# EasyEDA schematic Scheme_EasyEda_PM_Razvan_Bitea.json

## Sheets
1 Interfața serială și paralelă: TITLE: Interfața serială și paralelă; REV: 1.0
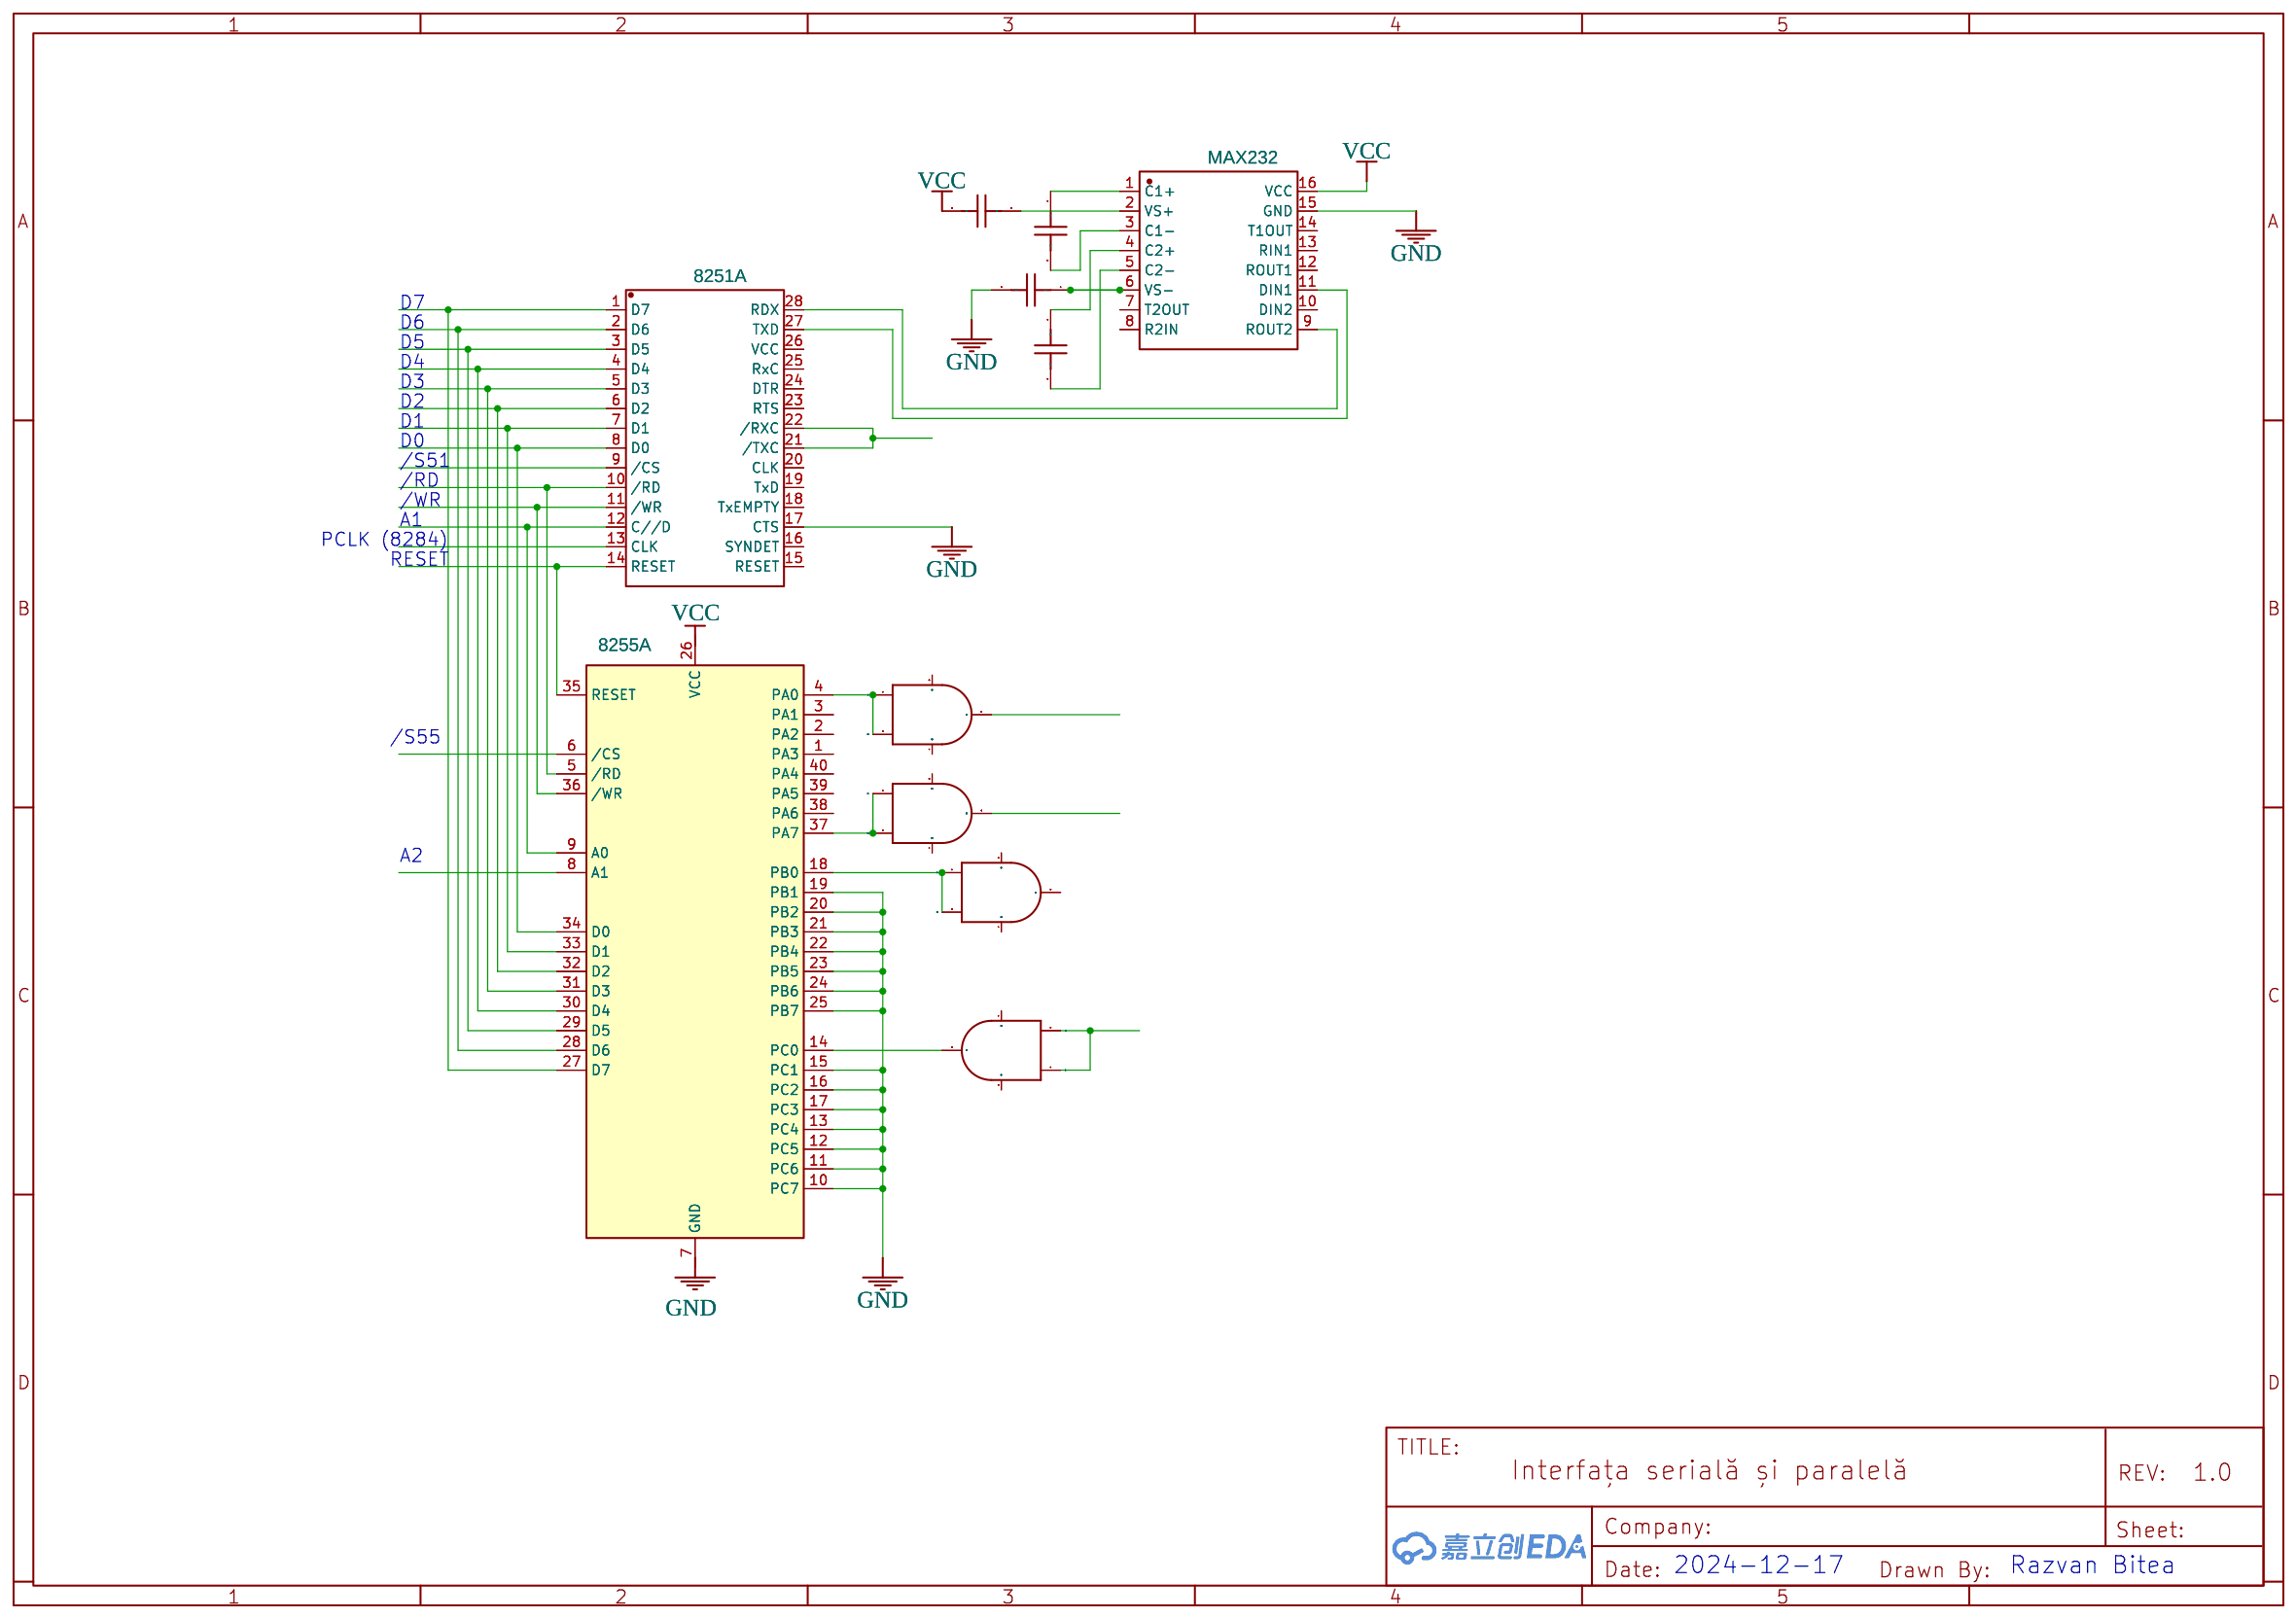
[diagram p0: Interfața serială și paralelă]
2 Conectarea memoriilor: TITLE: Conectarea memoriilor
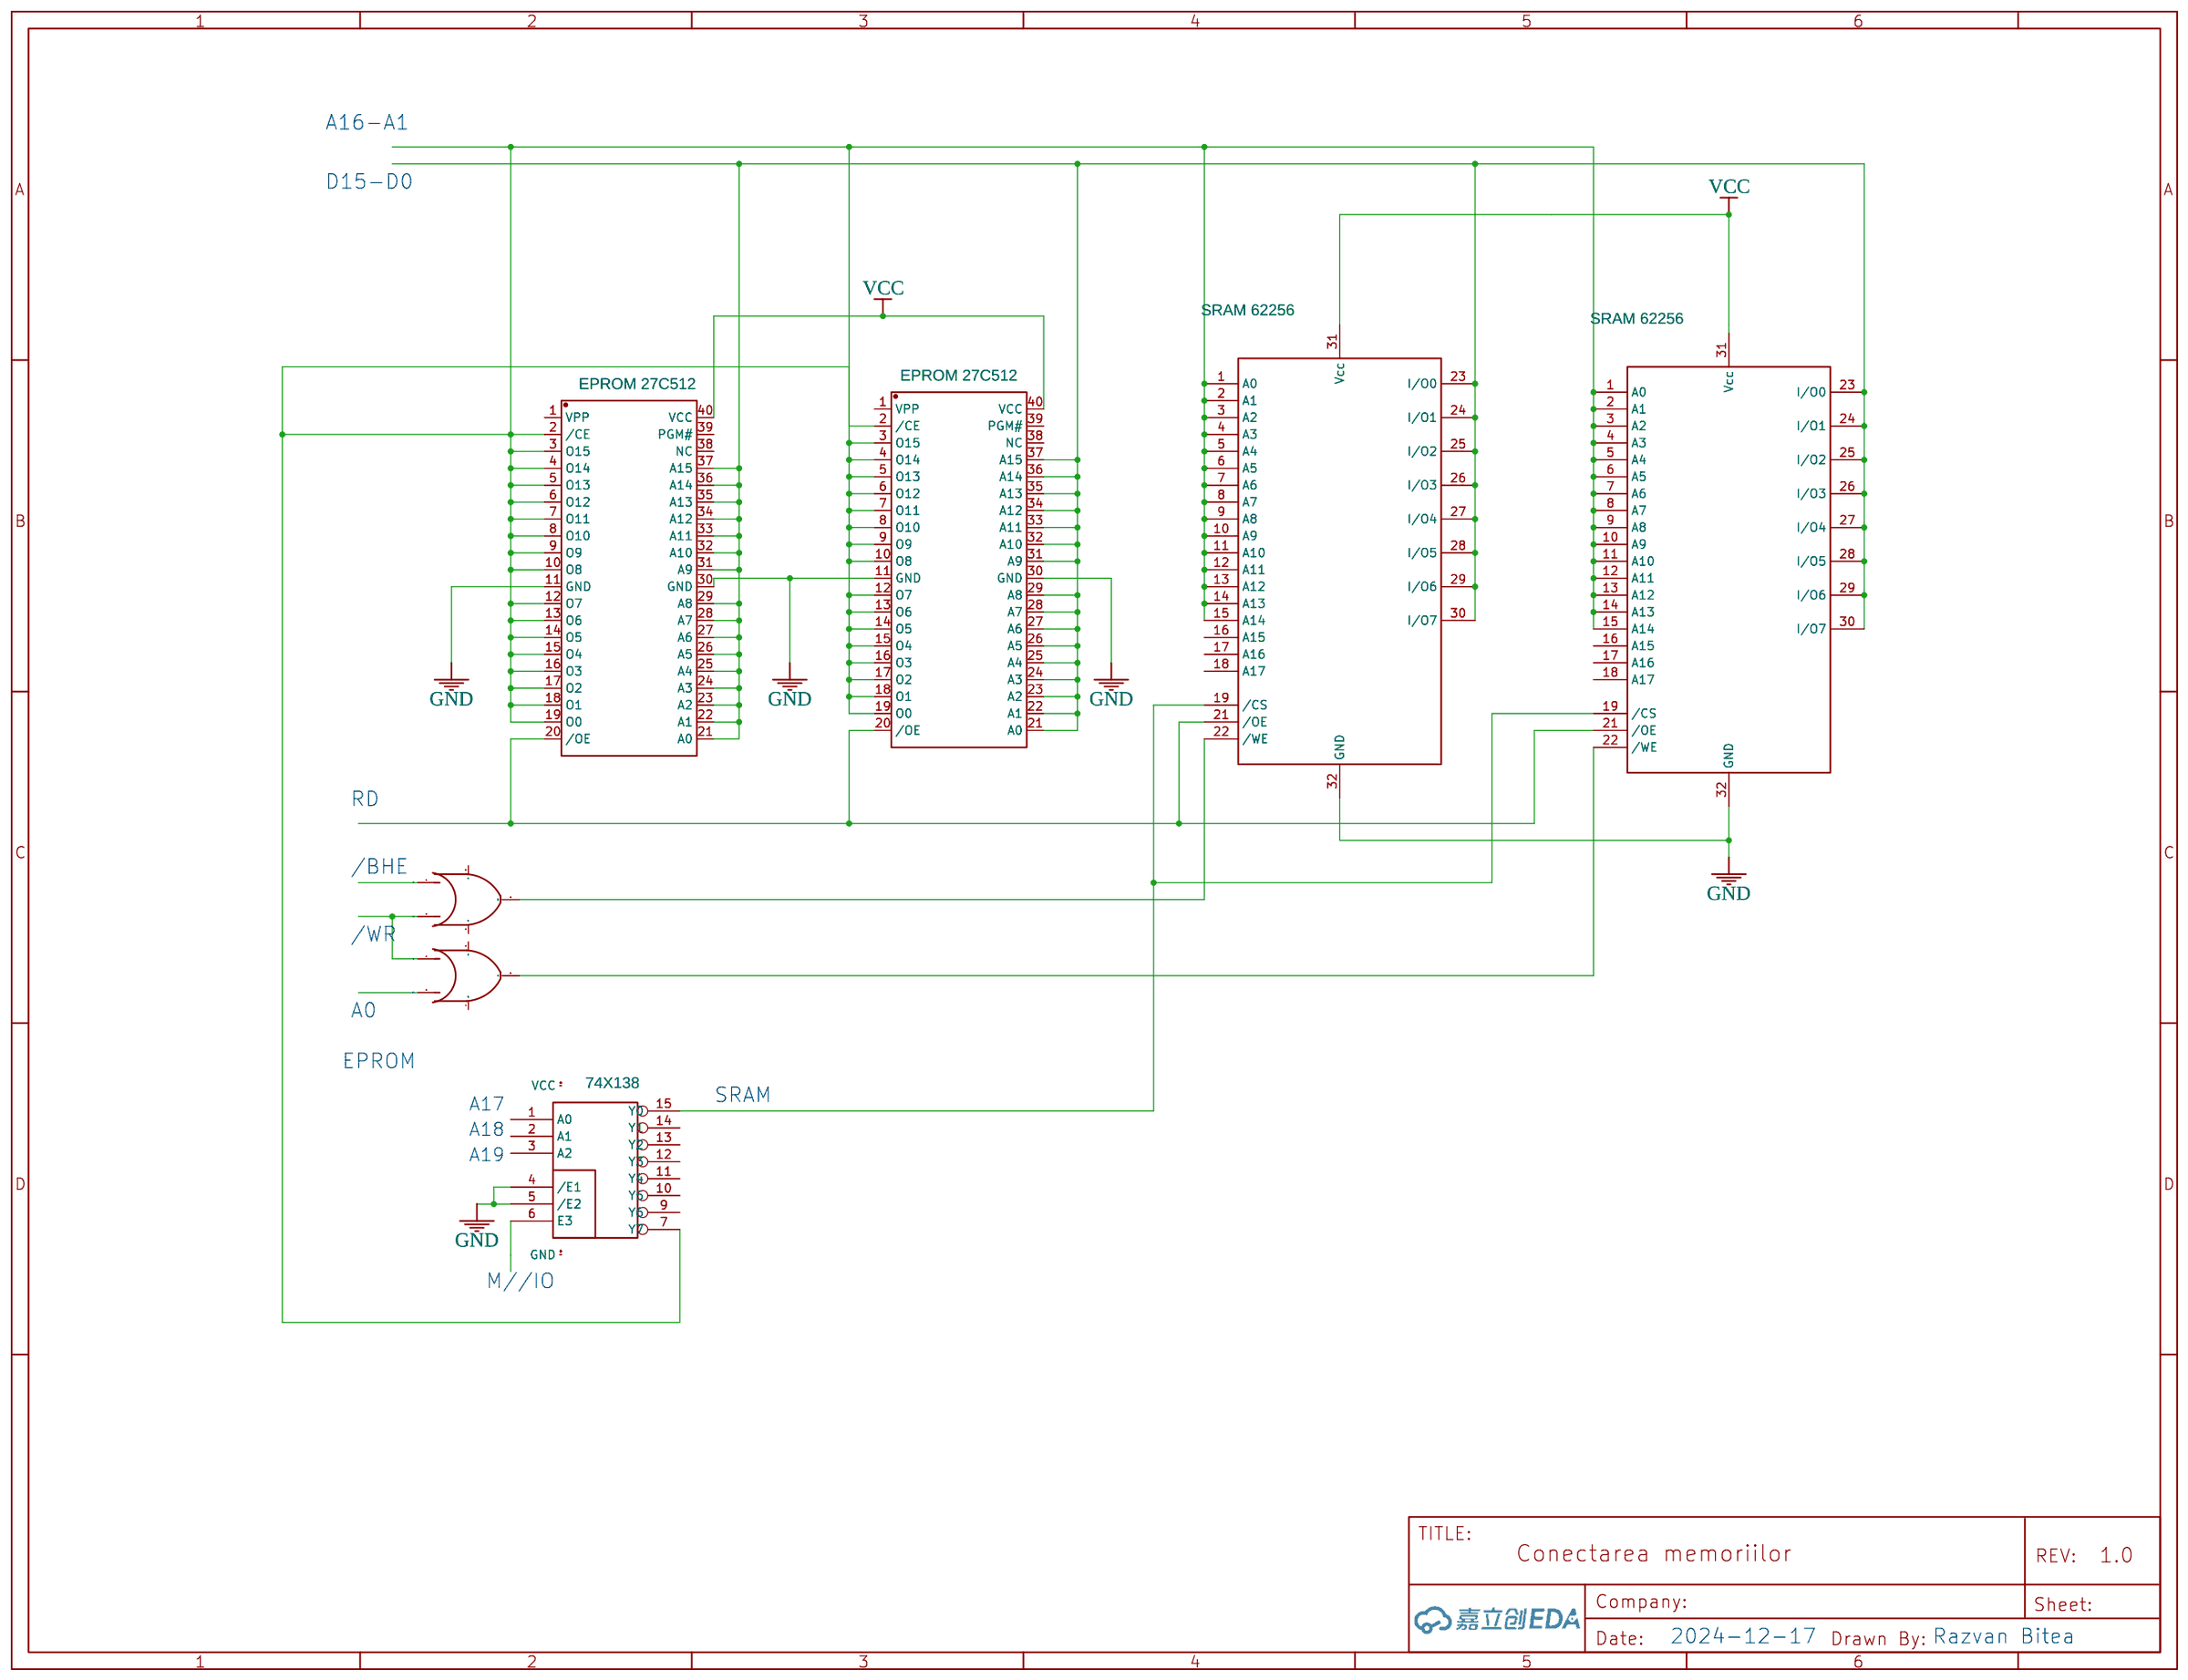
[diagram p1: Conectarea memoriilor]
3 Unitatea Centrală: TITLE: Unitatea Centrală
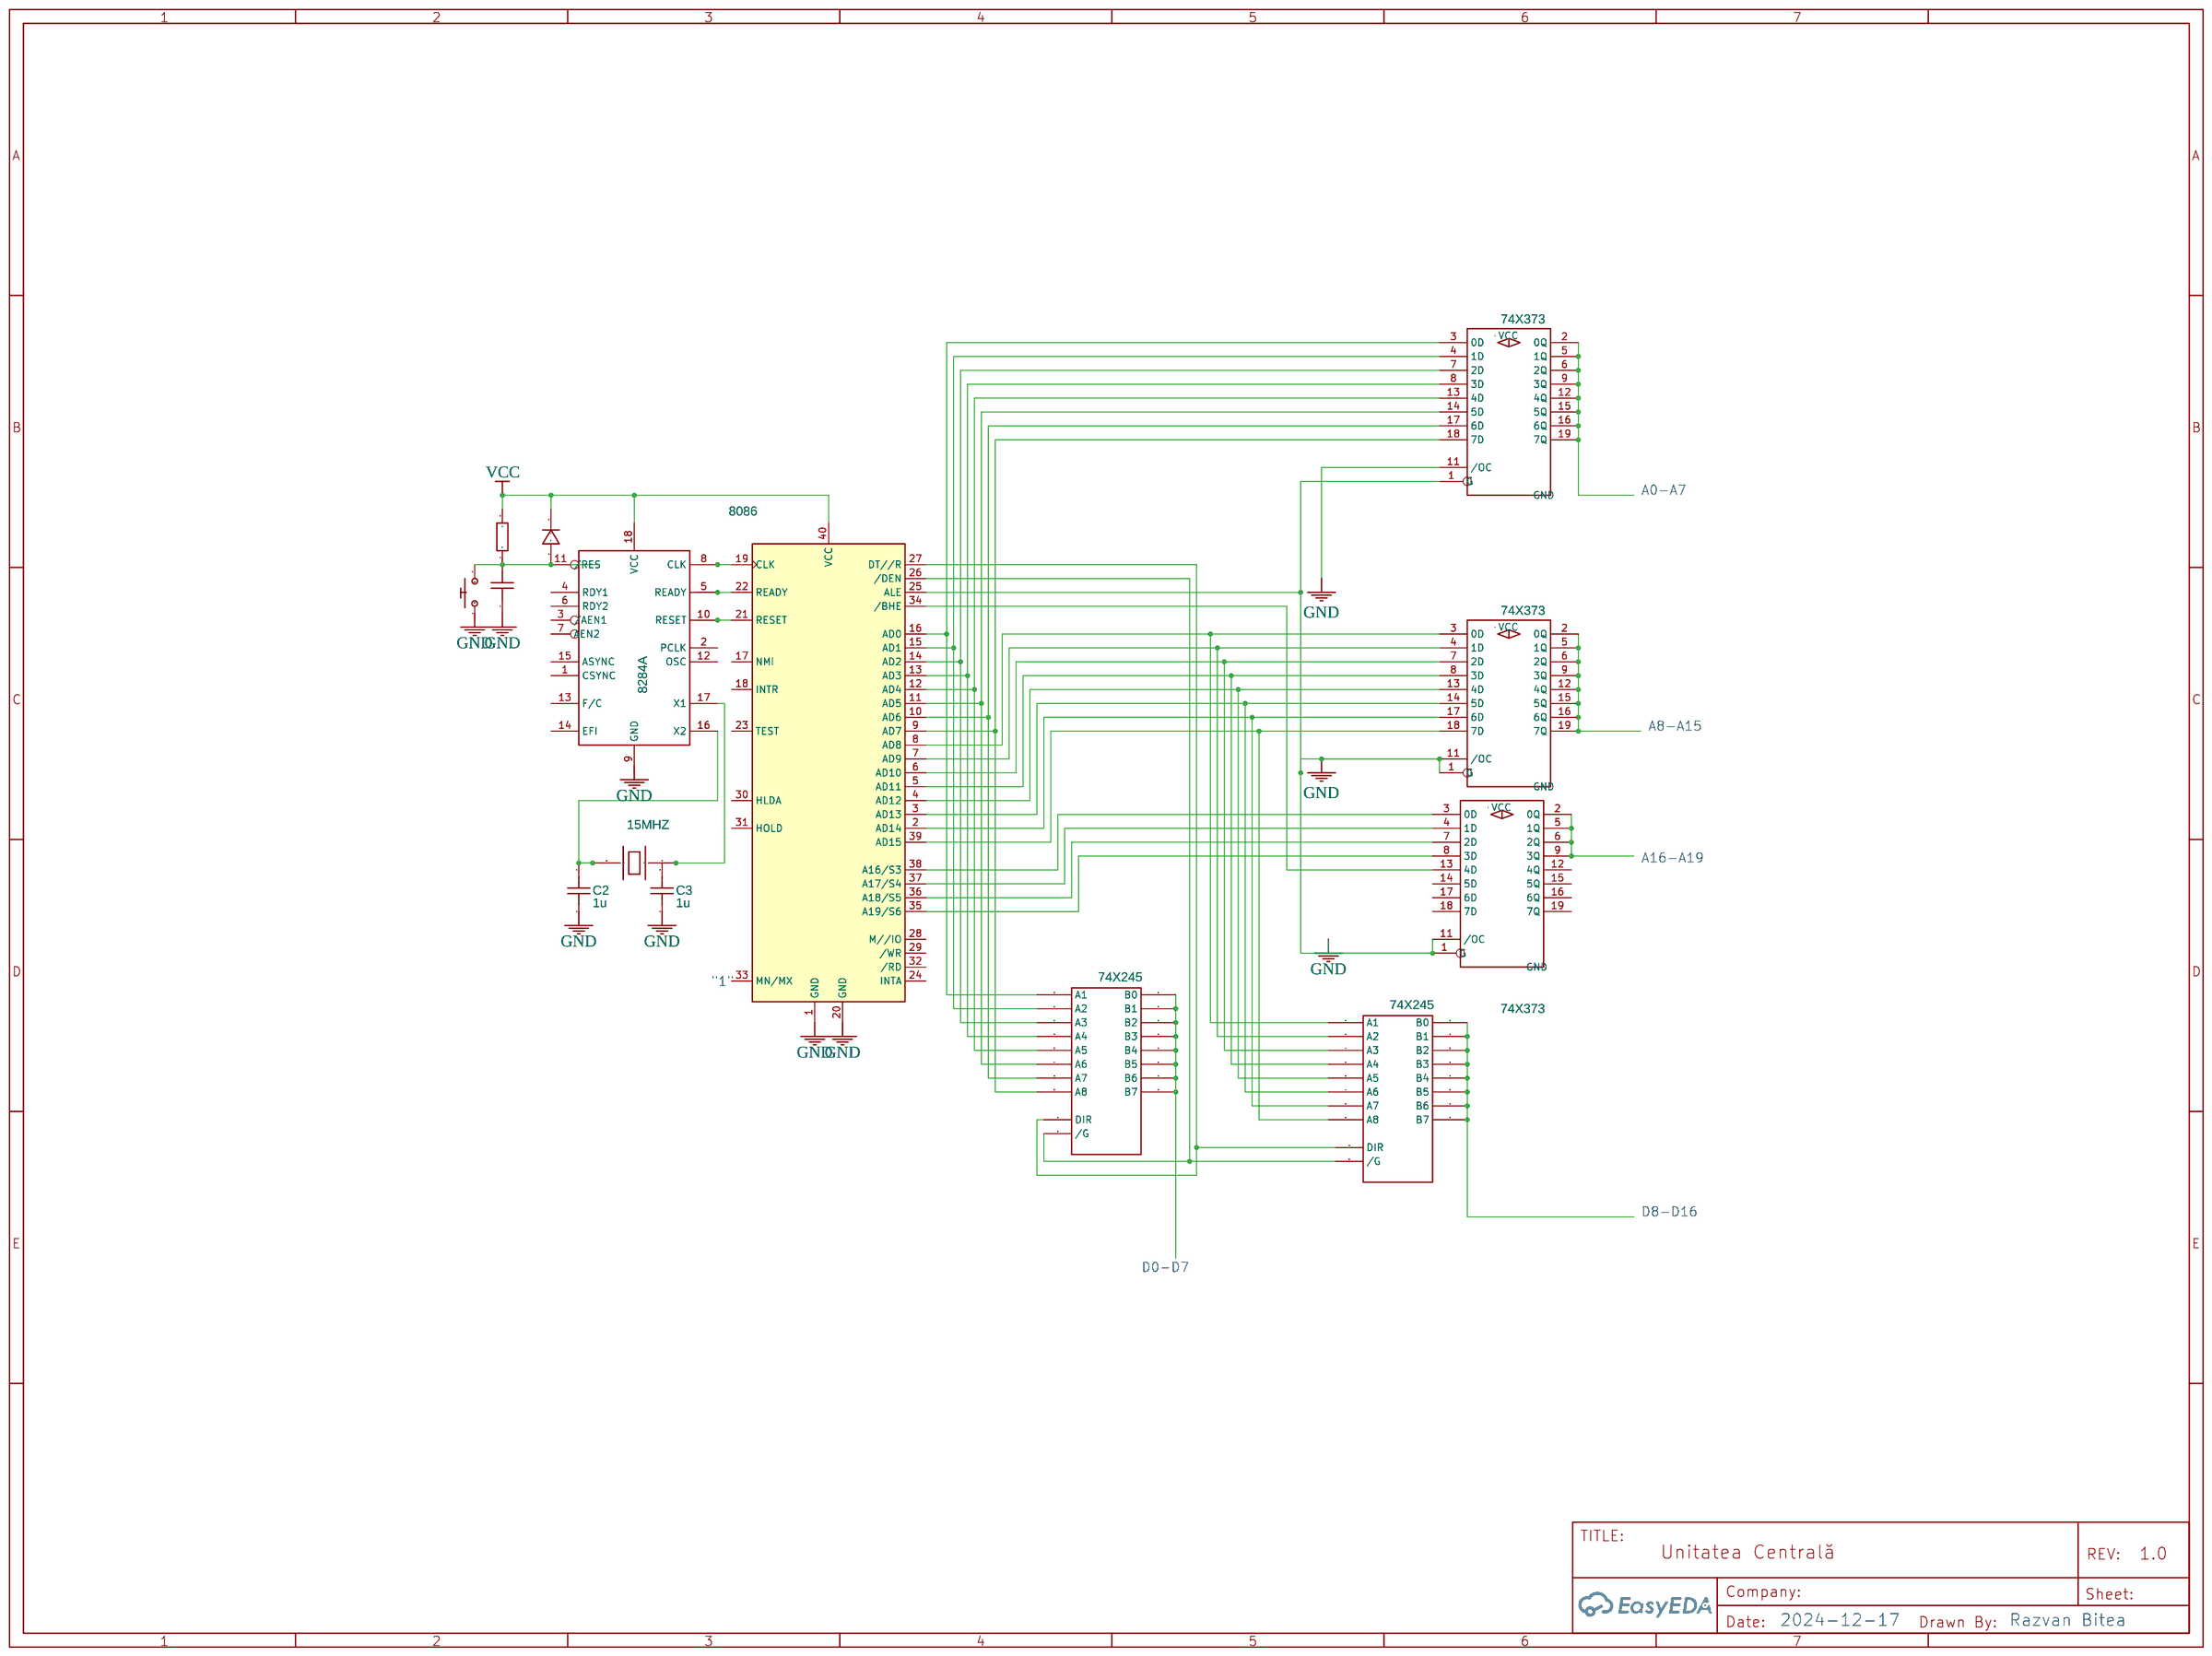
[diagram p2: Unitatea Centrală]
4 Minitastatura: TITLE: Minitastatura
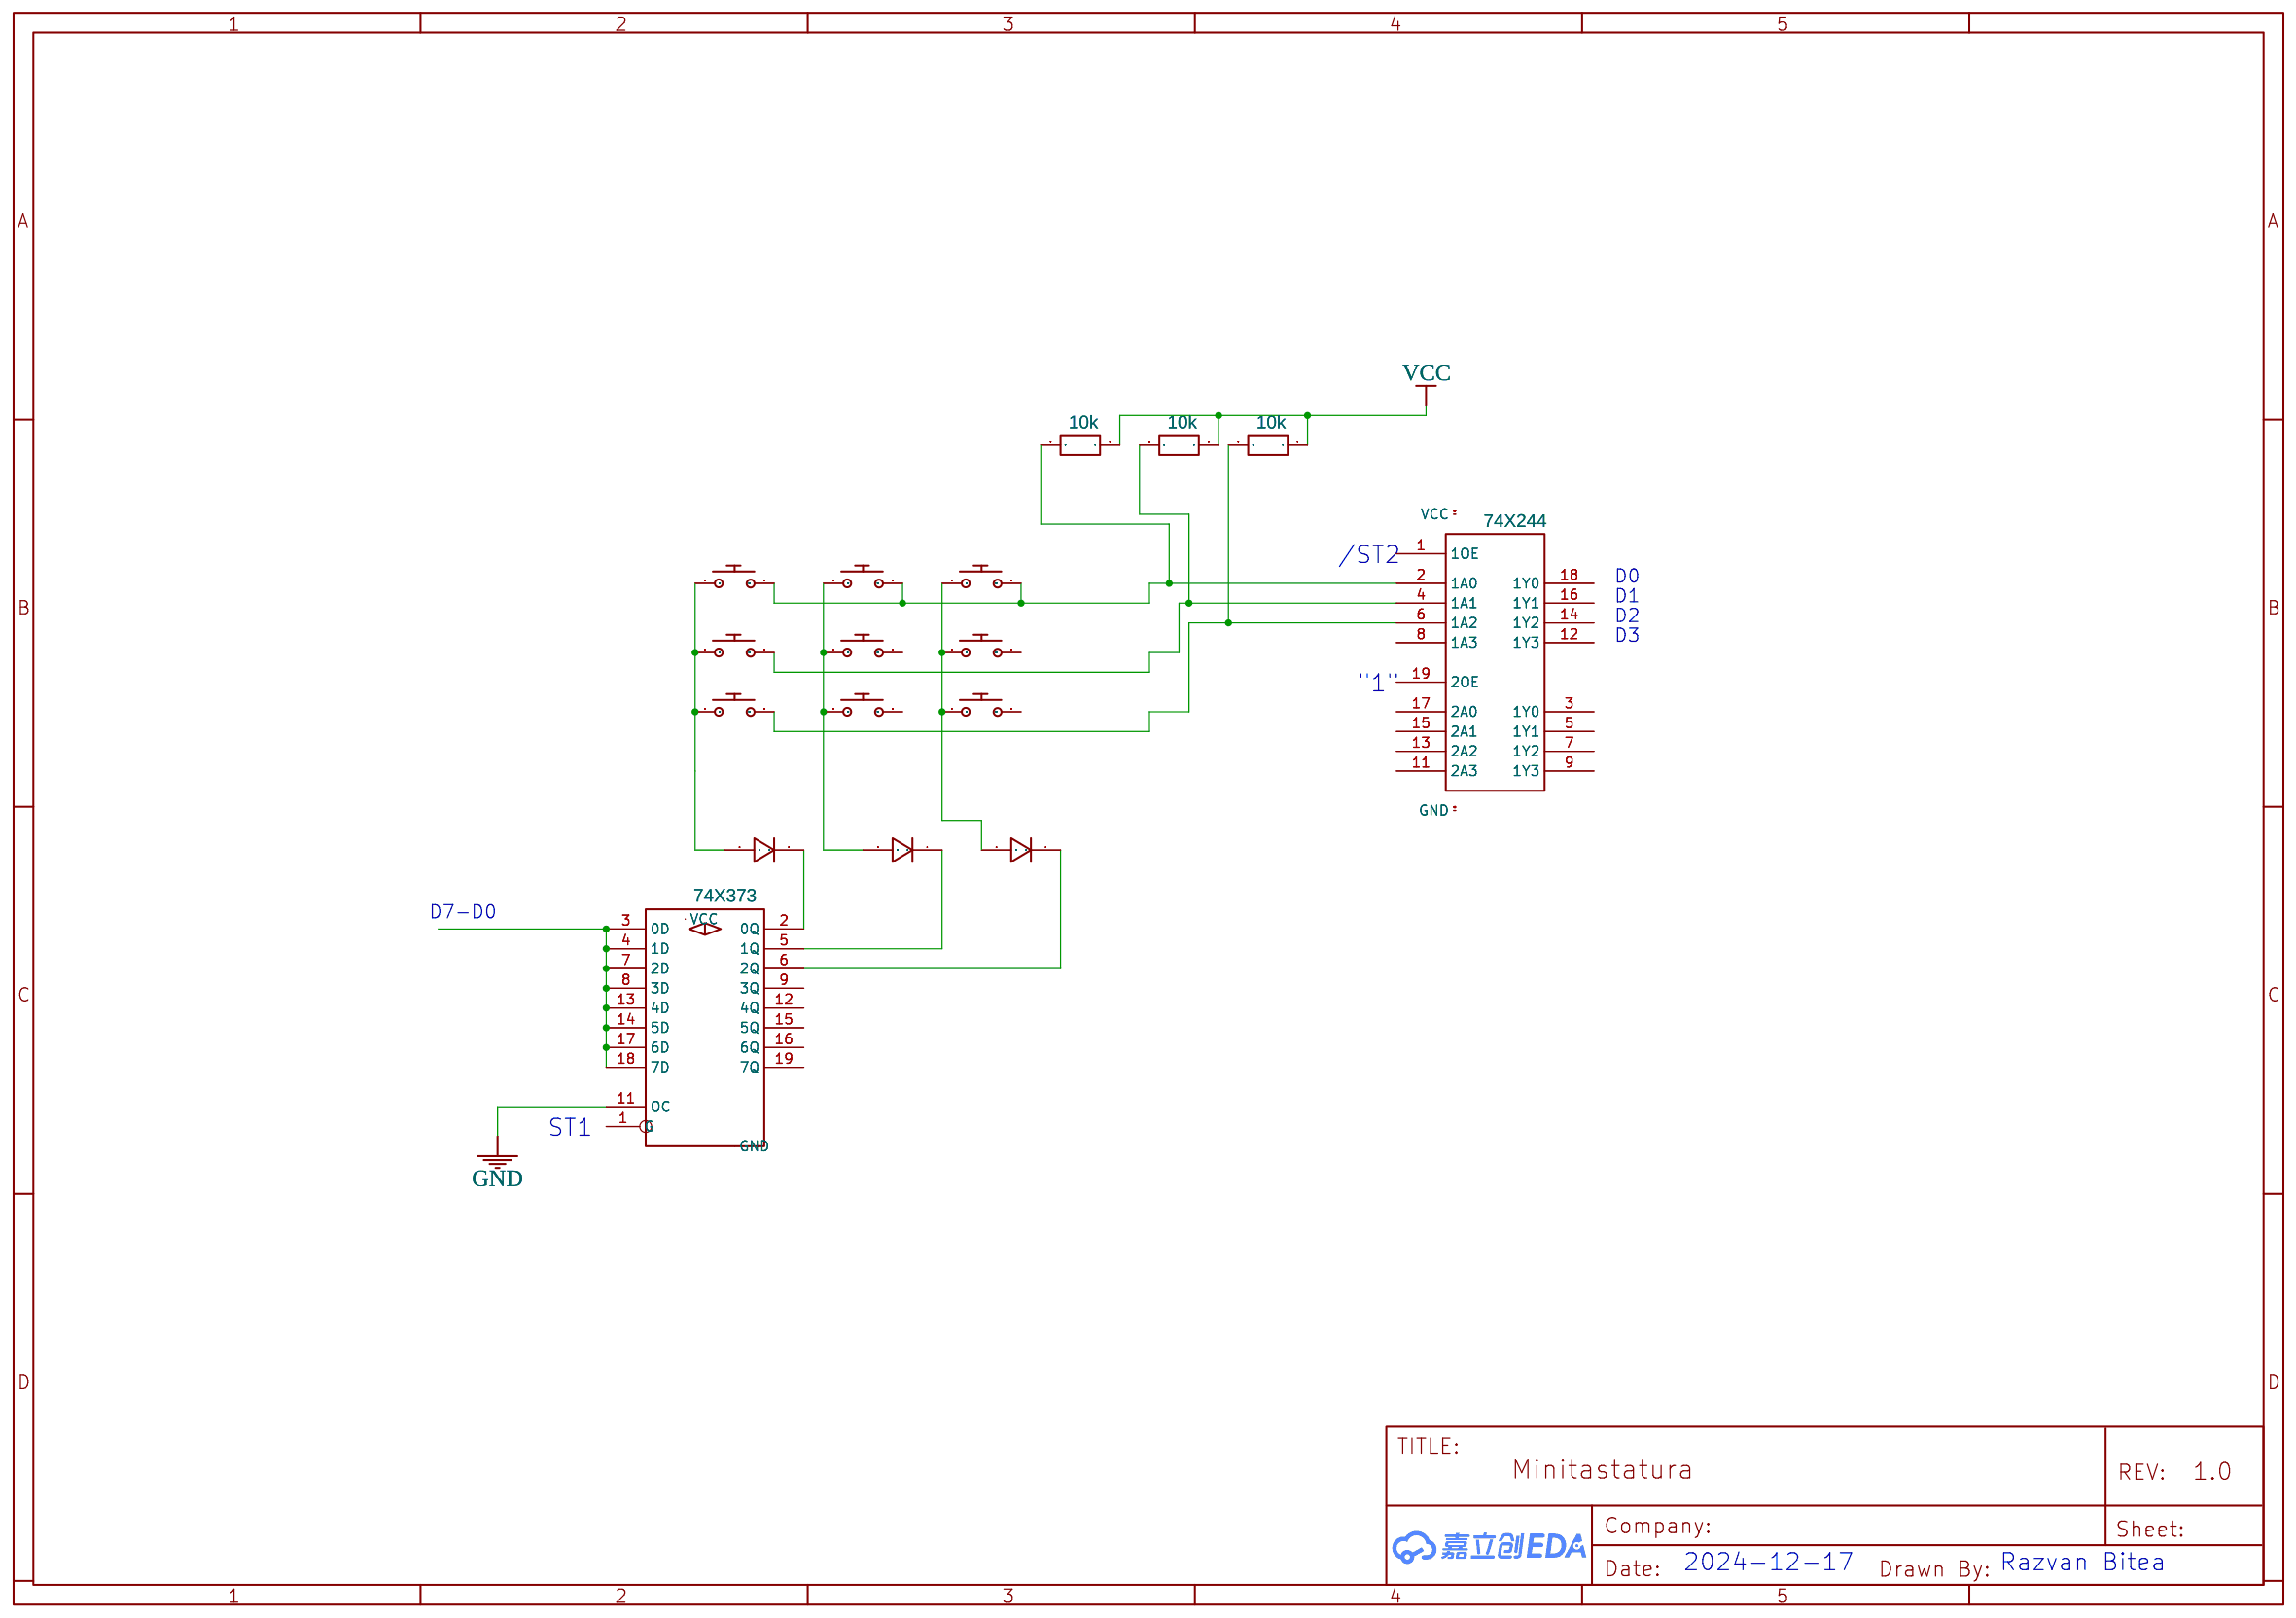
[diagram p3: Minitastatura]
5 LED-uri: TITLE: LED-uri
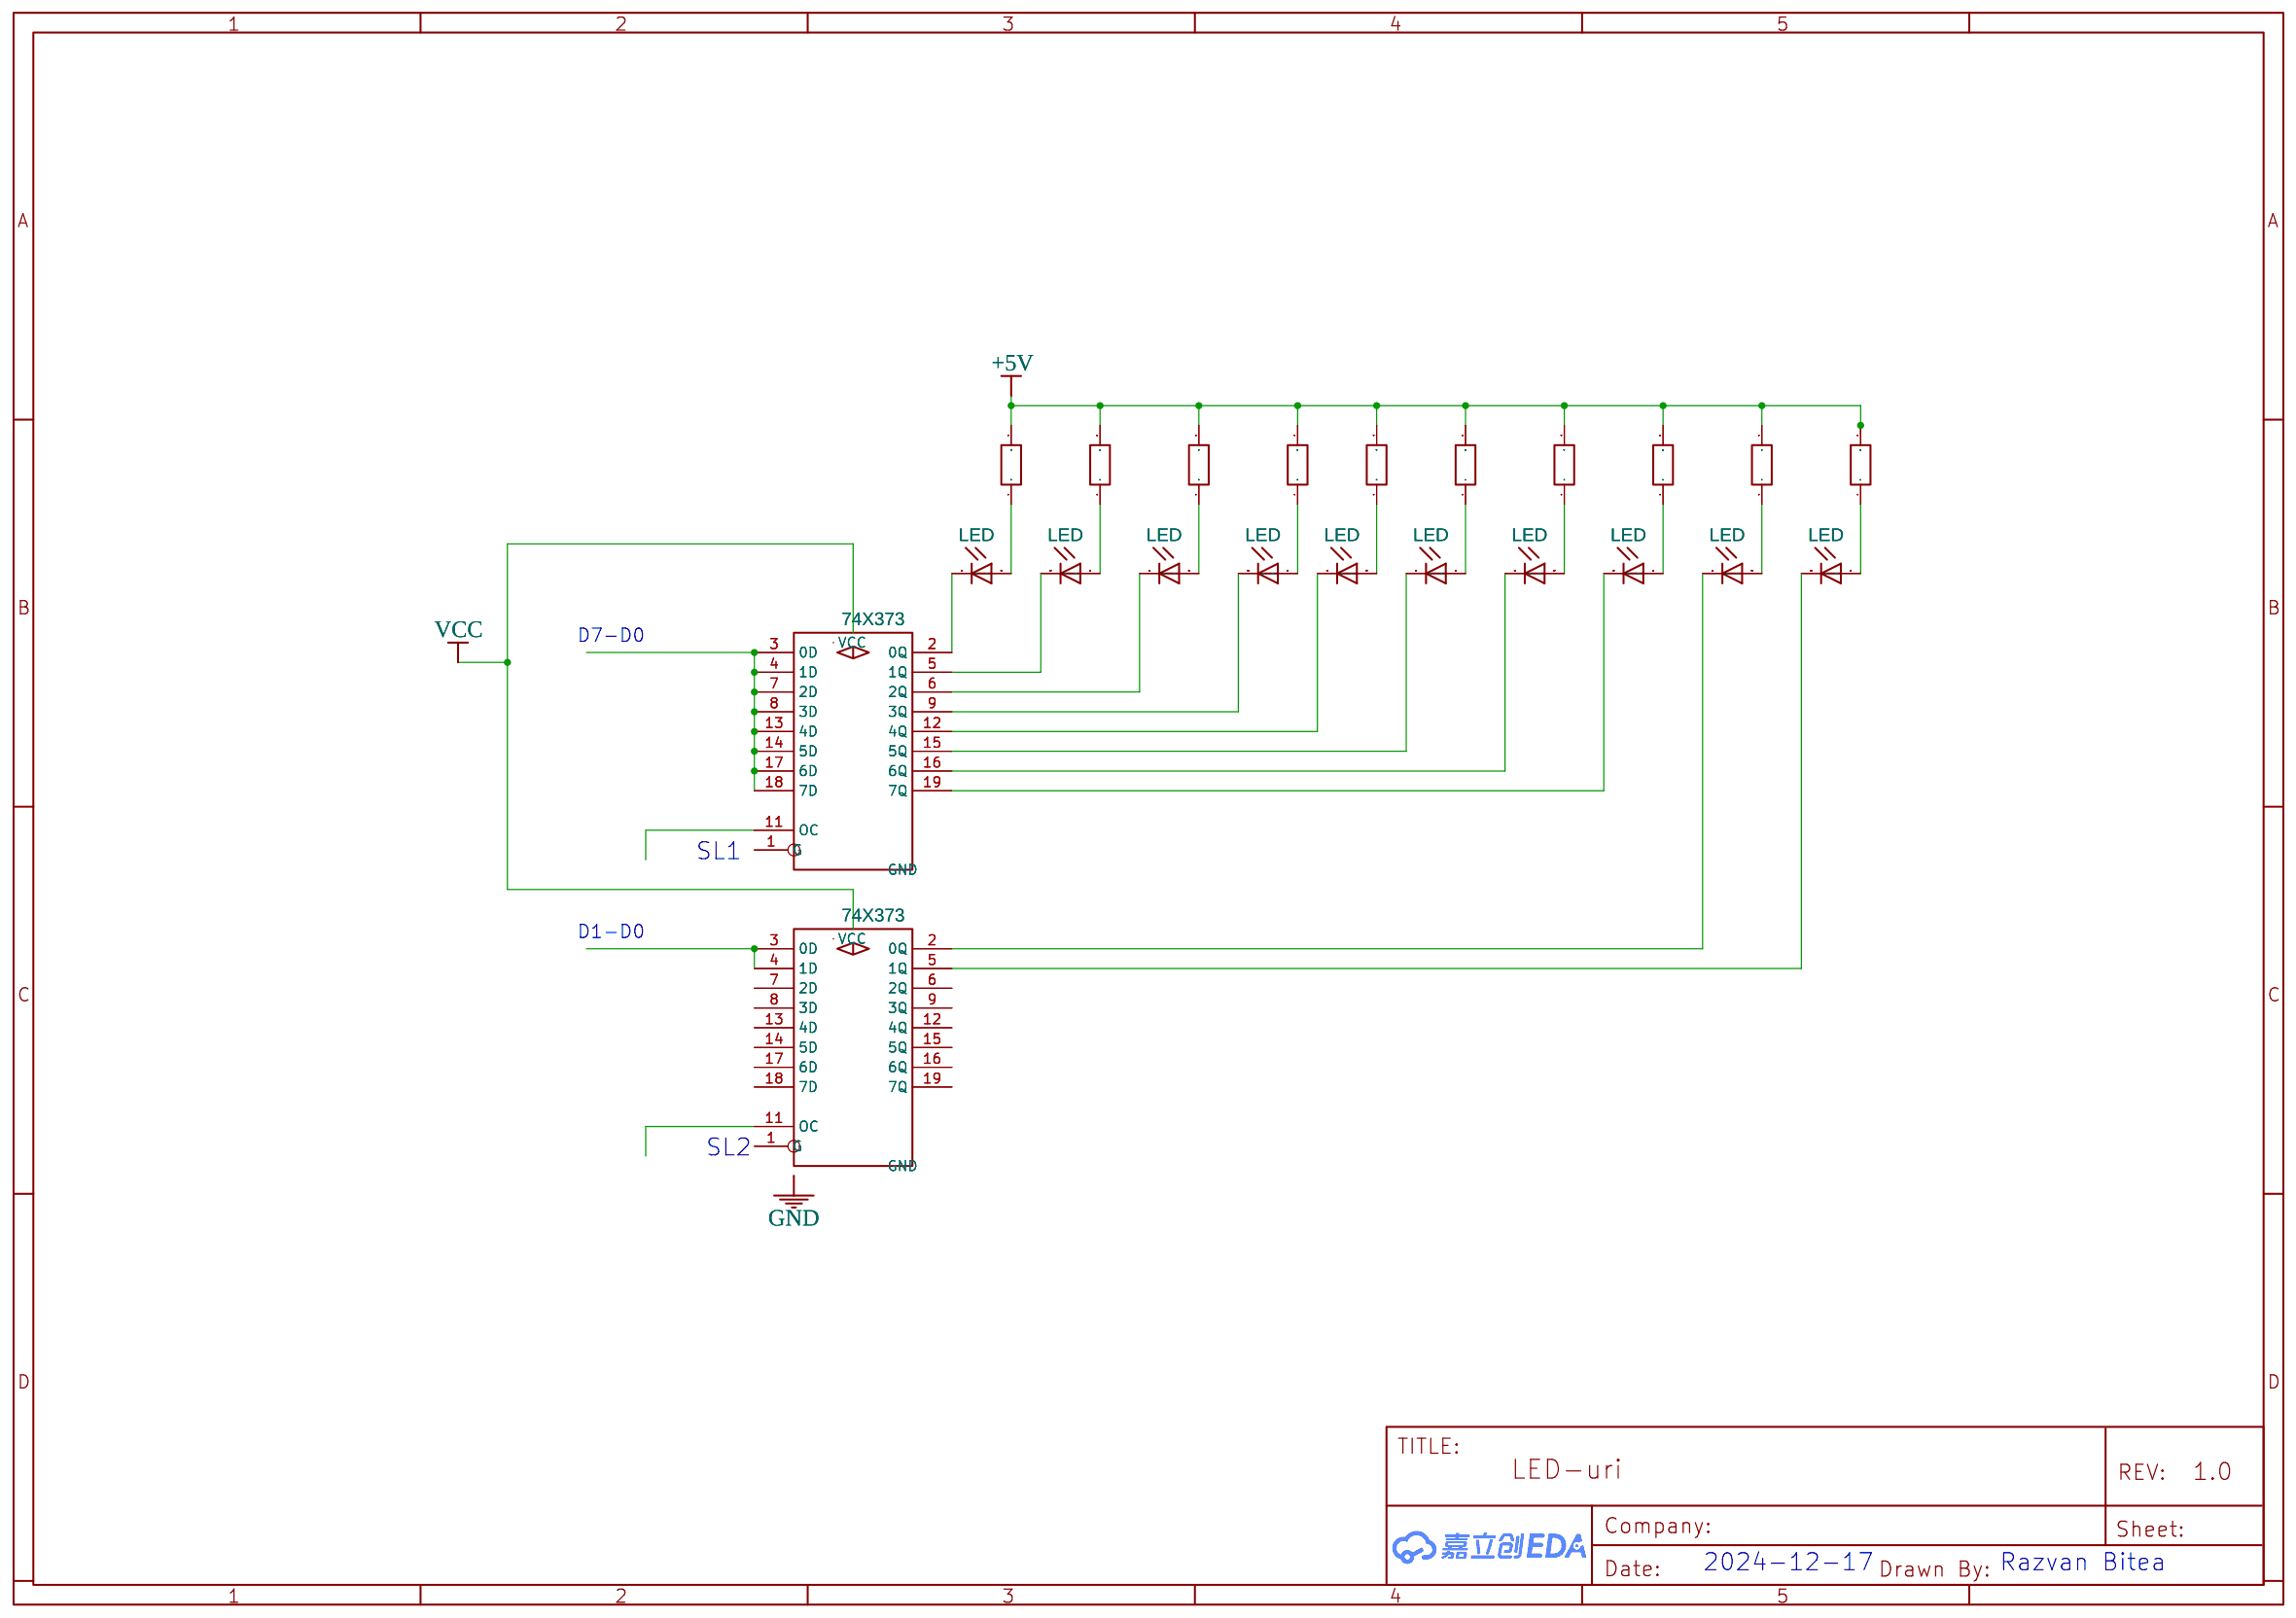
[diagram p4: LED-uri]
6 Decodificatorul de porturi: TITLE: Decodificatorul de porturi
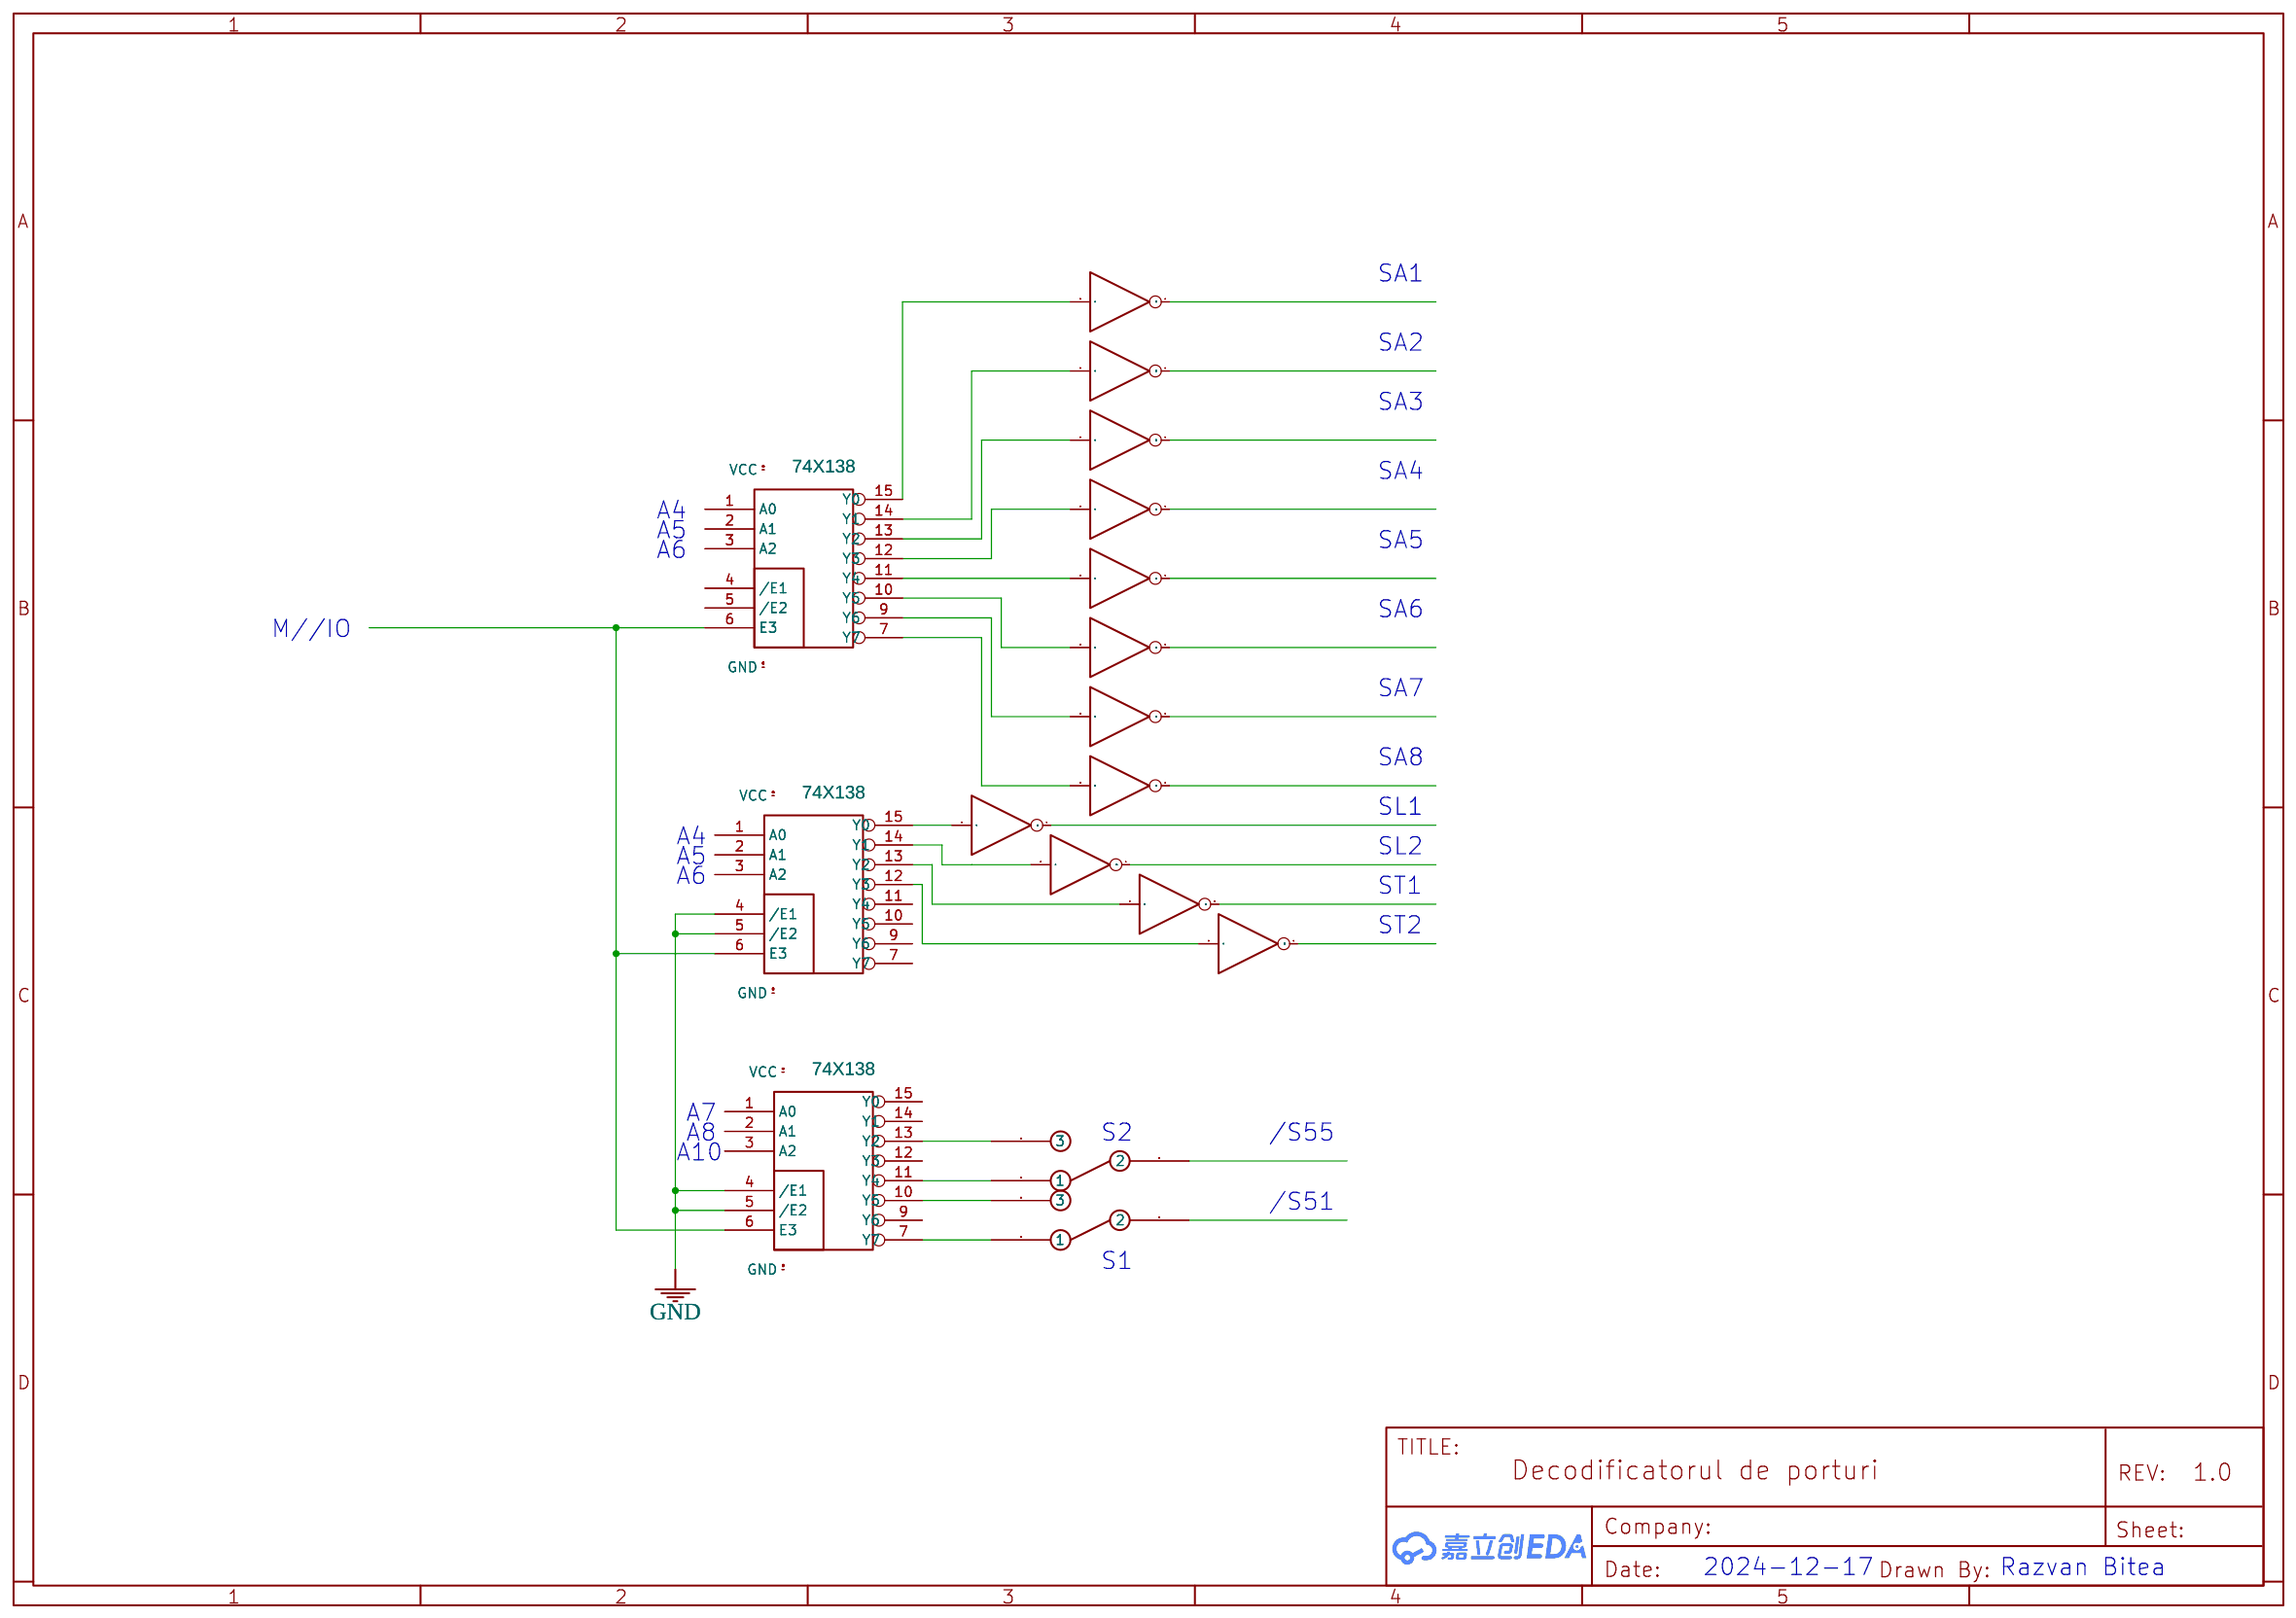
[diagram p5: Decodificatorul de porturi]
7 Afișare segmente: TITLE: Afișare segmente
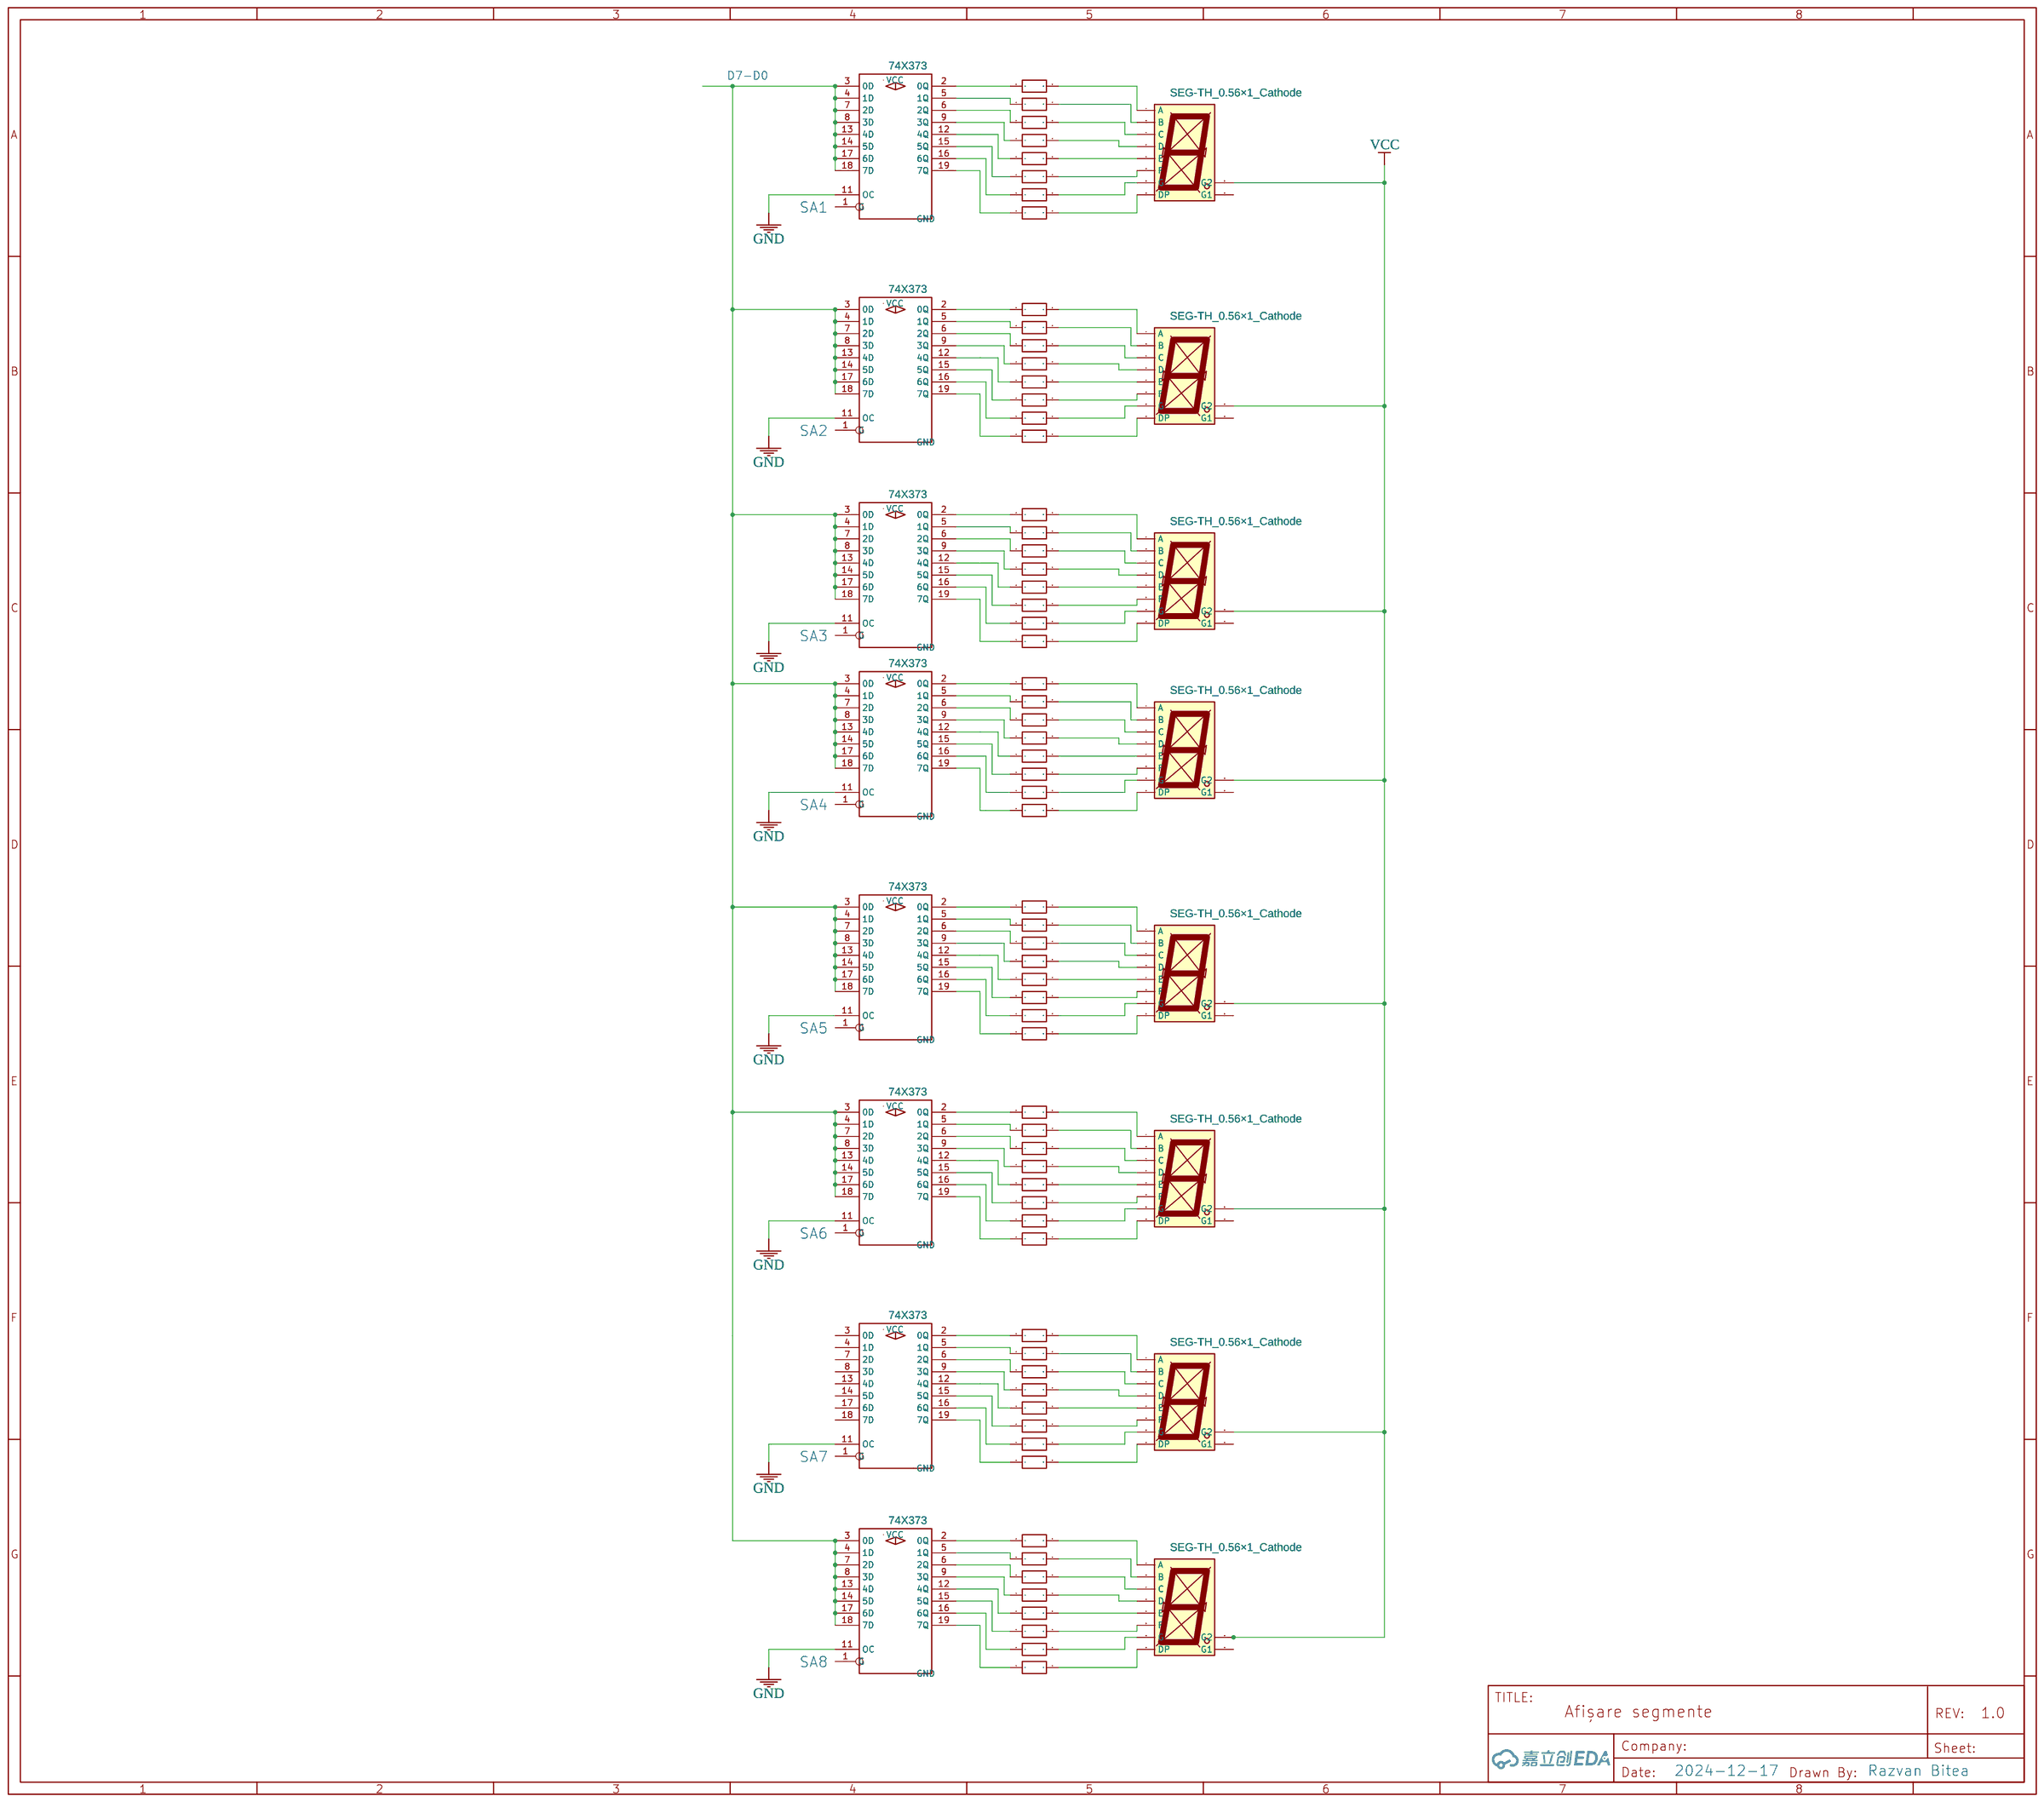
[diagram p6: Afișare segmente]

## Parts
sheet Afișare segmente
R14  1k  [R0603]
R15  1k  [R0603]
R16  1k  [R0603]
R17  1k  [R0603]
R18  1k  [R0603]
R19  1k  [R0603]
R20  1k  [R0603]
R21  1k  [R0603]
R22  1k  [R0603]
R23  1k  [R0603]
R24  1k  [R0603]
R25  1k  [R0603]
R26  1k  [R0603]
R27  1k  [R0603]
R28  1k  [R0603]
R29  1k  [R0603]
R30  1k  [R0603]
R31  1k  [R0603]
R32  1k  [R0603]
R33  1k  [R0603]
R34  1k  [R0603]
R35  1k  [R0603]
R36  1k  [R0603]
R37  1k  [R0603]
R38  1k  [R0603]
R39  1k  [R0603]
R40  1k  [R0603]
R41  1k  [R0603]
R42  1k  [R0603]
R43  1k  [R0603]
R44  1k  [R0603]
R45  1k  [R0603]
R46  1k  [R0603]
R47  1k  [R0603]
R48  1k  [R0603]
R49  1k  [R0603]
R50  1k  [R0603]
R51  1k  [R0603]
R52  1k  [R0603]
R53  1k  [R0603]
R54  1k  [R0603]
R55  1k  [R0603]
R56  1k  [R0603]
R57  1k  [R0603]
R58  1k  [R0603]
R59  1k  [R0603]
R60  1k  [R0603]
R61  1k  [R0603]
R62  1k  [R0603]
R63  1k  [R0603]
R64  1k  [R0603]
R65  1k  [R0603]
R66  1k  [R0603]
R67  1k  [R0603]
R68  1k  [R0603]
R69  1k  [R0603]
R70  1k  [R0603]
R71  1k  [R0603]
R72  1k  [R0603]
R73  1k  [R0603]
R74  1k  [R0603]
R75  1k  [R0603]
R76  1k  [R0603]
R77  1k  [R0603]
SEG1  SEG-TH_0.56×1_Cathode  [LED-SEG-TH_10P-L12.6-W19.0-P2.54-S15.24-BL]
SEG2  SEG-TH_0.56×1_Cathode  [LED-SEG-TH_10P-L12.6-W19.0-P2.54-S15.24-BL]
SEG3  SEG-TH_0.56×1_Cathode  [LED-SEG-TH_10P-L12.6-W19.0-P2.54-S15.24-BL]
SEG4  SEG-TH_0.56×1_Cathode  [LED-SEG-TH_10P-L12.6-W19.0-P2.54-S15.24-BL]
SEG5  SEG-TH_0.56×1_Cathode  [LED-SEG-TH_10P-L12.6-W19.0-P2.54-S15.24-BL]
SEG6  SEG-TH_0.56×1_Cathode  [LED-SEG-TH_10P-L12.6-W19.0-P2.54-S15.24-BL]
SEG7  SEG-TH_0.56×1_Cathode  [LED-SEG-TH_10P-L12.6-W19.0-P2.54-S15.24-BL]
SEG8  SEG-TH_0.56×1_Cathode  [LED-SEG-TH_10P-L12.6-W19.0-P2.54-S15.24-BL]
U69  74X373  [DIP20]
U70  74X373  [DIP20]
U71  74X373  [DIP20]
U72  74X373  [DIP20]
U73  74X373  [DIP20]
U74  74X373  [DIP20]
U75  74X373  [DIP20]
U76  74X373  [DIP20]
sheet Conectarea memoriilor
U9  74X138  [IC16]
U10  EPROM 27C512  [PDIP-40_L52.3-W13.8-P2.54-LS15.2-BL]
U11  EPROM 27C512  [PDIP-40_L52.3-W13.8-P2.54-LS15.2-BL]
U12  SRAM 62256  [62512]
U13  SRAM 62256  [62512]
U14  OrGate  [DIP]
U15  OrGate  [DIP]
sheet Decodificatorul de porturi
SW1  1_2_Both_Switch  [DPDT PADDLE SWITCH MOUNTAIN SWITCH]
SW2  1_2_Both_Switch  [DPDT PADDLE SWITCH MOUNTAIN SWITCH]
U8  INVERTER
U16  74X138  [IC16]
U17  74X138  [IC16]
U18  74X138  [IC16]
U19  INVERTER
U21  INVERTER
U22  INVERTER
U23  INVERTER
U24  INVERTER
U25  INVERTER
U26  INVERTER
U27  INVERTER
U28  INVERTER
U77  INVERTER
U78  INVERTER
sheet Interfața serială și paralelă
C4  0.1u  [C0603]
C5  0.1u  [C0603]
C6  0.1u  [C0603]
C7  0.1u  [C0603]
U20  8251A  [DIP-28_L37.0-W13.8-P2.54-LS15.8-BL]
U60  8255A  [DIP-40_W15.24MM]
U61  MAX232  [PDIP-16_L19.7-W6.6-P2.54-LS7.6-BL]
U62  AND2EE_US
U63  AND2EE_US
U64  AND2EE_US
U67  AND2EE_US
sheet LED-uri
LED1  LED  [CHIPLED-0603-TTW]
LED2  LED  [CHIPLED-0603-TTW]
LED3  LED  [CHIPLED-0603-TTW]
LED4  LED  [CHIPLED-0603-TTW]
LED5  LED  [CHIPLED-0603-TTW]
LED6  LED  [CHIPLED-0603-TTW]
LED7  LED  [CHIPLED-0603-TTW]
LED8  LED  [CHIPLED-0603-TTW]
LED9  LED  [CHIPLED-0603-TTW]
LED10  LED  [CHIPLED-0603-TTW]
R6  1k  [R0603]
R7  1k  [R0603]
R8  1k  [R0603]
R9  1k  [R0603]
R10  1k  [R0603]
R11  1k  [R0603]
R12  1k  [R0603]
R13  1k  [R0603]
R78  1k  [R0603]
R79  1k  [R0603]
U68  74X373  [DIP20]
U79  74X373  [DIP20]
sheet Minitastatura
D2  1N4007W  [SOD-123_L2.8-W1.8-LS3.7-RD]
D3  1N4007W  [SOD-123_L2.8-W1.8-LS3.7-RD]
D4  1N4007W  [SOD-123_L2.8-W1.8-LS3.7-RD]
R2  10k  [R0603]
R3  10k  [R0603]
R4  10k  [R0603]
SW-2SWITCH  Push Button  [SMD-BUTTON]
SW-3SWITCH  Push Button  [SMD-BUTTON]
SW-4SWITCH  Push Button  [SMD-BUTTON]
SW-7SWITCH  Push Button  [SMD-BUTTON]
SW-8SWITCH  Push Button  [SMD-BUTTON]
SW-9SWITCH  Push Button  [SMD-BUTTON]
SW-11SWITCH  Push Button  [SMD-BUTTON]
SW-12SWITCH  Push Button  [SMD-BUTTON]
SW-13SWITCH  Push Button  [SMD-BUTTON]
U65  74X244  [IC20]
U66  74X373  [DIP20]
sheet Unitatea Centrală
15MHZ  SMAQ-5032A  [IQG5032A]
C1  C1  [RAD-0.1]
C2  1u  [RAD-0.1]
C3  1u  [RAD-0.1]
D1  1N4448  [DO-35]
R1  1k  [AXIAL-0.3]
SW-1SWITCH  Push Button  [SMD-BUTTON]
U1  8086  [DIP-40_W15.24MM]
U2  74X373  [DIP20]
U3  8284A  [DIP18]
U4  74X373  [DIP20]
U5  74X373  [DIP20]
U6  74X245  [IC20]
U7  74X245  [IC20]

## Library data of the parts
R2-R4 R6-R79 = R_0603_EU: Contributor: LCEDA_Lib
SEG1-SEG8 = SEG-TH_0.56×1_Cathode: Manufacturer: 志浩; Supplier Part: C8093; Contributor: LCEDA_01
U2 U4 U5 U66 U68-U76 U79 = 74X373N: Octal Transparent Latch with 3-State Outputs; Contributor: Rhyno
U9 U16-U18 = 74X138: Contributor: KiCad
U10 U11 = AT27C1024-45PU: Supplier: LCSC; Supplier Part: C220831; Manufacturer: Microchip Tech; Contributor: LCSC; JLCPCB Part Class: Extended Part
U12 U13 = SRAM 62512: Manufacturer Part: x; Contributor: laurovicimihaela
U14 U15 = OrGate: Contributor: andyfierman
SW1 SW2 = 1_2_Both_Switch: Contributor: iuliavoit
U8 U19 U21-U28 U77 U78 = LOGIC: Contributor: ale.tuninetti; sim: true
C4-C7 = C_0603_US: Contributor: LCEDA_Lib
U20 = P8251A: Manufacturer: Microchip Tech; Manufacturer Part: AT27C256R-45PU; Contributor: Peter2022; JLCPCB Part Class: Extended Part
U60 = 8255A: Contributor: JohnH1234
U61 = MAX232EING4: Supplier: LCSC; Supplier Part: C1545083; Manufacturer: TI(德州仪器); link: https://atta.szlcsc.comnull; Contributor: lcsc
U62-U64 U67 = LOGIC: Contributor: EasyEDA
LED1-LED10 = LED: Contributor: Adafruit
D2-D4 = 1N4007W: Supplier: LCSC; Supplier Part: C328592; Manufacturer: BLUE ROCKET; Contributor: LCEDA_Lib
SW-1SWITCH SW-2SWITCH SW-3SWITCH SW-4SWITCH SW-7SWITCH SW-8SWITCH SW-9SWITCH SW-11SWITCH SW-12SWITCH SW-13SWITCH = -: sourceId: M82WewO60; Supplier Part: COM-08720; Supplier: SparkFun; Manufacturer Part: ?
U65 = 74X244: Contributor: KiCad
15MHZ = -: Manufacturer Part: ?
C1-C3 = Cap_RAD-0.1_US: Manufacturer Part: ?
D1 = -: Supplier Part: C54037; Supplier: LCSC; Manufacturer: SEMTECH; image: //image.lceda.cn/szlcsc/C54037.jpg
R1 = Res_AXIAL-0.3(1/8W)_EU: Manufacturer Part: ?
U1 = -: Contributor: KiCAD; license: https://www.gnu.org/licenses/lgpl-2.1.html; Manufacturer Part: ?
U3 = 8284A: Contributor: rory.slegtenhorst; sourceId: BnlH3MK6Q; Manufacturer Part: ?
U6 U7 = 74X245: Contributor: ioana; Package Display: No

## Nets
+5V: R6.2 R7.2 R8.2 R9.2 R10.2 R11.2 R12.2 R13.2 R78.2 R79.2
GND: C1.1 C5.2 U1.1(GND) U1.20(GND) U1.25(ALE) U2.1(G) U2.11(/OC) U4.1(G) U4.11(/OC) U5.1(G) U5.11(/OC) U9.4(/E1) U9.5(/E2) U10.11(GND) U10.30(GND) U11.11(GND) U11.30(GND) U12.32(GND) U13.32(GND) U17.4(/E1) U17.5(/E2) U18.4(/E1) U18.5(/E2) U20.17(CTS) U60.10(PC7) U60.11(PC6) U60.12(PC5) U60.13(PC4) U60.15(PC1) U60.16(PC2) U60.17(PC3) U60.19(PB1) U60.20(PB2) U60.21(PB3) U60.22(PB4) U60.23(PB5) U60.24(PB6) U60.25(PB7) U61.15(GND) U66.11(OC) U69.11(OC) U70.11(OC) U71.11(OC) U72.11(OC) U73.11(OC) U74.11(OC) U75.11(OC) U76.11(OC)
VCC: C7.2 D1.2(K) R1.2 R2.1 R3.1 R4.1 SEG1.8(G2) SEG2.8(G2) SEG3.8(G2) SEG4.8(G2) SEG5.8(G2) SEG6.8(G2) SEG7.8(G2) SEG8.8(G2) U1.40(VCC) U3.18(VCC) U10.40(VCC) U11.40(VCC) U12.31(Vcc) U13.31(Vcc) U61.16(VCC)
Net-(15MHZ-P$1): 15MHZ.P$1(PIN1) C3.2 U3.17(X1)
Net-(15MHZ-P$2): 15MHZ.P$2(PIN2) C2.2 U3.16(X2)
Net-(C1-2): C1.2 D1.1(A) R1.1 SW-1SWITCH.2(P$2) U3.11(/RES)
Net-(C4-1): C4.1 U61.1(C1+)
Net-(C4-2): C4.2 U61.3(C1-)
Net-(C5-1): C5.1 U61.6(VS-)
Net-(C6-1): C6.1 U61.4(C2+)
Net-(C6-2): C6.2 U61.5(C2-)
Net-(C7-1): C7.1 U61.2(VS+)
Net-(D2-1): D2.1 U66.2(0Q)
Net-(D2-2): D2.2 SW-2SWITCH.1(P$1) SW-9SWITCH.1(P$1) SW-13SWITCH.1(P$1)
Net-(D3-1): D3.1 U66.5(1Q)
Net-(D3-2): D3.2 SW-3SWITCH.1(P$1) SW-8SWITCH.1(P$1) SW-12SWITCH.1(P$1)
Net-(D4-1): D4.1 U66.6(2Q)
Net-(D4-2): D4.2 SW-4SWITCH.1(P$1) SW-7SWITCH.1(P$1) SW-11SWITCH.1(P$1)
Net-(LED1-A@1): LED1.A@1(A) R6.1
Net-(LED1-C@1): LED1.C@1(C) U68.2(0Q)
Net-(LED2-A@1): LED2.A@1(A) R7.1
Net-(LED2-C@1): LED2.C@1(C) U68.5(1Q)
Net-(LED3-A@1): LED3.A@1(A) R8.1
Net-(LED3-C@1): LED3.C@1(C) U68.6(2Q)
Net-(LED4-A@1): LED4.A@1(A) R9.1
Net-(LED4-C@1): LED4.C@1(C) U68.9(3Q)
Net-(LED5-A@1): LED5.A@1(A) R13.1
Net-(LED5-C@1): LED5.C@1(C) U68.19(7Q)
Net-(LED6-A@1): LED6.A@1(A) R12.1
Net-(LED6-C@1): LED6.C@1(C) U68.16(6Q)
Net-(LED7-A@1): LED7.A@1(A) R11.1
Net-(LED7-C@1): LED7.C@1(C) U68.15(5Q)
Net-(LED8-A@1): LED8.A@1(A) R10.1
Net-(LED8-C@1): LED8.C@1(C) U68.12(4Q)
Net-(LED9-A@1): LED9.A@1(A) R79.1
Net-(LED9-C@1): LED9.C@1(C) U79.2(0Q)
Net-(LED10-A@1): LED10.A@1(A) R78.1
Net-(LED10-C@1): LED10.C@1(C) U79.5(1Q)
Net-(R2-2): R2.2 SW-2SWITCH.2(P$2) SW-3SWITCH.2(P$2) SW-4SWITCH.2(P$2) U65.2(1A0)
Net-(R3-2): R3.2 SW-9SWITCH.2(P$2) U65.4(1A1)
Net-(R4-2): R4.2 SW-13SWITCH.2(P$2) U65.6(1A2)
Net-(R14-1): R14.1 U69.2(0Q)
Net-(R14-2): R14.2 SEG1.7(A)
Net-(R15-1): R15.1 U69.5(1Q)
Net-(R15-2): R15.2 SEG1.6(B)
Net-(R16-1): R16.1 U69.6(2Q)
Net-(R16-2): R16.2 SEG1.4(C)
Net-(R17-1): R17.1 U69.9(3Q)
Net-(R17-2): R17.2 SEG1.2(D)
Net-(R18-1): R18.1 U69.12(4Q)
Net-(R18-2): R18.2 SEG1.1(E)
Net-(R19-1): R19.1 U69.15(5Q)
Net-(R19-2): R19.2 SEG1.9(F)
Net-(R20-1): R20.1 U69.16(6Q)
Net-(R20-2): R20.2 SEG1.10(G)
Net-(R21-1): R21.1 U69.19(7Q)
Net-(R21-2): R21.2 SEG1.5(DP)
Net-(R22-1): R22.1 U70.19(7Q)
Net-(R22-2): R22.2 SEG2.5(DP)
Net-(R23-1): R23.1 U70.16(6Q)
Net-(R23-2): R23.2 SEG2.10(G)
Net-(R24-1): R24.1 U70.15(5Q)
Net-(R24-2): R24.2 SEG2.9(F)
Net-(R25-1): R25.1 U70.12(4Q)
Net-(R25-2): R25.2 SEG2.1(E)
Net-(R26-1): R26.1 U70.9(3Q)
Net-(R26-2): R26.2 SEG2.2(D)
Net-(R27-1): R27.1 U70.6(2Q)
Net-(R27-2): R27.2 SEG2.4(C)
Net-(R28-1): R28.1 U70.5(1Q)
Net-(R28-2): R28.2 SEG2.6(B)
Net-(R29-1): R29.1 U70.2(0Q)
Net-(R29-2): R29.2 SEG2.7(A)
Net-(R30-1): R30.1 U71.19(7Q)
Net-(R30-2): R30.2 SEG3.5(DP)
Net-(R31-1): R31.1 U71.16(6Q)
Net-(R31-2): R31.2 SEG3.10(G)
Net-(R32-1): R32.1 U71.15(5Q)
Net-(R32-2): R32.2 SEG3.9(F)
Net-(R33-1): R33.1 U71.12(4Q)
Net-(R33-2): R33.2 SEG3.1(E)
Net-(R34-1): R34.1 U71.9(3Q)
Net-(R34-2): R34.2 SEG3.2(D)
Net-(R35-1): R35.1 U71.6(2Q)
Net-(R35-2): R35.2 SEG3.4(C)
Net-(R36-1): R36.1 U71.5(1Q)
Net-(R36-2): R36.2 SEG3.6(B)
Net-(R37-1): R37.1 U71.2(0Q)
Net-(R37-2): R37.2 SEG3.7(A)
Net-(R38-1): R38.1 U74.19(7Q)
Net-(R38-2): R38.2 SEG4.5(DP)
Net-(R39-1): R39.1 U74.16(6Q)
Net-(R39-2): R39.2 SEG4.10(G)
Net-(R40-1): R40.1 U74.15(5Q)
Net-(R40-2): R40.2 SEG4.9(F)
Net-(R41-1): R41.1 U74.12(4Q)
Net-(R41-2): R41.2 SEG4.1(E)
Net-(R42-1): R42.1 U74.9(3Q)
Net-(R42-2): R42.2 SEG4.2(D)
Net-(R43-1): R43.1 U74.6(2Q)
Net-(R43-2): R43.2 SEG4.4(C)
Net-(R44-1): R44.1 U74.5(1Q)
Net-(R44-2): R44.2 SEG4.6(B)
Net-(R45-1): R45.1 U74.2(0Q)
Net-(R45-2): R45.2 SEG4.7(A)
Net-(R46-1): R46.1 U73.19(7Q)
Net-(R46-2): R46.2 SEG5.5(DP)
Net-(R47-1): R47.1 U73.16(6Q)
Net-(R47-2): R47.2 SEG5.10(G)
Net-(R48-1): R48.1 U73.15(5Q)
Net-(R48-2): R48.2 SEG5.9(F)
Net-(R49-1): R49.1 U73.12(4Q)
Net-(R49-2): R49.2 SEG5.1(E)
Net-(R50-1): R50.1 U73.9(3Q)
Net-(R50-2): R50.2 SEG5.2(D)
Net-(R51-1): R51.1 U73.6(2Q)
Net-(R51-2): R51.2 SEG5.4(C)
Net-(R52-1): R52.1 U73.5(1Q)
Net-(R52-2): R52.2 SEG5.6(B)
Net-(R53-1): R53.1 U73.2(0Q)
Net-(R53-2): R53.2 SEG5.7(A)
Net-(R54-1): R54.1 U72.19(7Q)
Net-(R54-2): R54.2 SEG6.5(DP)
Net-(R55-1): R55.1 U72.16(6Q)
Net-(R55-2): R55.2 SEG6.10(G)
Net-(R56-1): R56.1 U72.15(5Q)
Net-(R56-2): R56.2 SEG6.9(F)
Net-(R57-1): R57.1 U72.12(4Q)
Net-(R57-2): R57.2 SEG6.1(E)
Net-(R58-1): R58.1 U72.9(3Q)
Net-(R58-2): R58.2 SEG6.2(D)
Net-(R59-1): R59.1 U72.6(2Q)
Net-(R59-2): R59.2 SEG6.4(C)
Net-(R60-1): R60.1 U72.5(1Q)
Net-(R60-2): R60.2 SEG6.6(B)
Net-(R61-1): R61.1 U72.2(0Q)
Net-(R61-2): R61.2 SEG6.7(A)
Net-(R62-1): R62.1 U76.2(0Q)
Net-(R62-2): R62.2 SEG7.7(A)
Net-(R63-1): R63.1 U76.5(1Q)
Net-(R63-2): R63.2 SEG7.6(B)
Net-(R64-1): R64.1 U76.6(2Q)
Net-(R64-2): R64.2 SEG7.4(C)
Net-(R65-1): R65.1 U76.9(3Q)
Net-(R65-2): R65.2 SEG7.2(D)
Net-(R66-1): R66.1 U76.12(4Q)
Net-(R66-2): R66.2 SEG7.1(E)
Net-(R67-1): R67.1 U76.15(5Q)
Net-(R67-2): R67.2 SEG7.9(F)
Net-(R68-1): R68.1 U76.16(6Q)
Net-(R68-2): R68.2 SEG7.10(G)
Net-(R69-1): R69.1 U76.19(7Q)
Net-(R69-2): R69.2 SEG7.5(DP)
Net-(R70-1): R70.1 U75.2(0Q)
Net-(R70-2): R70.2 SEG8.7(A)
Net-(R71-1): R71.1 U75.5(1Q)
Net-(R71-2): R71.2 SEG8.6(B)
Net-(R72-1): R72.1 U75.6(2Q)
Net-(R72-2): R72.2 SEG8.4(C)
Net-(R73-1): R73.1 U75.9(3Q)
Net-(R73-2): R73.2 SEG8.2(D)
Net-(R74-1): R74.1 U75.12(4Q)
Net-(R74-2): R74.2 SEG8.1(E)
Net-(R75-1): R75.1 U75.15(5Q)
Net-(R75-2): R75.2 SEG8.9(F)
Net-(R76-1): R76.1 U75.16(6Q)
Net-(R76-2): R76.2 SEG8.10(G)
Net-(R77-1): R77.1 U75.19(7Q)
Net-(R77-2): R77.2 SEG8.5(DP)
Net-(SW1-1): SW1.1 U18.11(Y4)
Net-(SW1-3): SW1.3 U18.13(Y2)
Net-(SW2-1): SW2.1 U18.7(Y7)
Net-(SW2-3): SW2.3 U18.10(Y5)
Net-(U1-2): U1.2(AD14) U2.17(6D) U6.8(A7)
Net-(U1-3): U1.3(AD13) U2.14(5D) U6.7(A6)
Net-(U1-4): U1.4(AD12) U2.13(4D) U6.6(A5)
Net-(U1-5): U1.5(AD11) U2.8(3D) U6.5(A4)
Net-(U1-6): U1.6(AD10) U2.7(2D) U6.4(A3)
Net-(U1-7): U1.7(AD9) U2.4(1D) U6.3(A2)
Net-(U1-8): U1.8(AD8) U2.3(0D) U6.2(A1)
Net-(U1-9): U1.9(AD7) U4.18(7D) U7.9(A8)
Net-(U1-10): U1.10(AD6) U4.17(6D) U7.8(A7)
Net-(U1-11): U1.11(AD5) U4.14(5D) U7.7(A6)
Net-(U1-12): U1.12(AD4) U4.13(4D) U7.6(A5)
Net-(U1-13): U1.13(AD3) U4.8(3D) U7.5(A4)
Net-(U1-14): U1.14(AD2) U4.7(2D) U7.4(A3)
Net-(U1-15): U1.15(AD1) U4.4(1D) U7.3(A2)
Net-(U1-16): U1.16(AD0) U4.3(0D) U7.2(A1)
Net-(U1-19): U1.19(CLK) U3.8(CLK)
Net-(U1-21): U1.21(RESET) U3.10(RESET)
Net-(U1-22): U1.22(READY) U3.5(READY)
Net-(U1-26): U1.26(/DEN) U6.21(/G) U7.21(/G)
Net-(U1-27): U1.27(DT//R) U6.20(DIR) U7.20(DIR)
Net-(U1-34): U1.34(/BHE) U5.13(4D)
Net-(U1-35): U1.35(A19/S6) U5.8(3D)
Net-(U1-36): U1.36(A18/S5) U5.7(2D)
Net-(U1-37): U1.37(A17/S4) U5.4(1D)
Net-(U1-38): U1.38(A16/S3) U5.3(0D)
Net-(U1-39): U1.39(AD15) U2.18(7D) U6.9(A8)
Net-(U2-2): U2.2(0Q) U2.5(1Q) U2.6(2Q) U2.9(3Q) U2.12(4Q) U2.15(5Q) U2.16(6Q) U2.19(7Q)
Net-(U4-2): U4.2(0Q) U4.5(1Q) U4.6(2Q) U4.9(3Q) U4.12(4Q) U4.15(5Q) U4.16(6Q) U4.19(7Q)
Net-(U5-2): U5.2(0Q) U5.5(1Q) U5.6(2Q) U5.9(3Q)
Net-(U6-11): U6.11(B7) U6.12(B6) U6.13(B5) U6.14(B4) U6.15(B3) U6.16(B2) U6.17(B1) U6.18(B0)
Net-(U7-11): U7.11(B7) U7.12(B6) U7.13(B5) U7.14(B4) U7.15(B3) U7.16(B2) U7.17(B1) U7.18(B0)
Net-(U8-1): U8.1(IN) U17.14(Y1)
Net-(U9-7): U9.7(Y7) U10.2(/CE) U10.3(O15) U10.4(O14) U10.5(O13) U10.6(O12) U10.7(O11) U10.8(O10) U10.9(O9) U10.10(O8) U10.12(O7) U10.13(O6) U10.14(O5) U10.15(O4) U10.16(O3) U10.17(O2) U10.18(O1) U10.19(O0) U11.2(/CE) U11.3(O15) U11.4(O14) U11.5(O13) U11.6(O12) U11.7(O11) U11.8(O10) U11.9(O9) U11.10(O8) U11.12(O7) U11.13(O6) U11.14(O5) U11.15(O4) U11.16(O3) U11.17(O2) U11.18(O1) U11.19(O0) U12.1(A0) U12.2(A1) U12.3(A2) U12.4(A3) U12.5(A4) U12.6(A5) U12.7(A6) U12.8(A7) U12.9(A8) U12.10(A9) U12.11(A10) U12.12(A11) U12.13(A12) U12.14(A13) U12.15(A14) U13.1(A0) U13.2(A1) U13.3(A2) U13.4(A3) U13.5(A4) U13.6(A5) U13.7(A6) U13.8(A7) U13.9(A8) U13.10(A9) U13.11(A10) U13.12(A11) U13.13(A12) U13.14(A13) U13.15(A14)
Net-(U9-15): U9.15(Y0) U12.19(/CS) U13.19(/CS)
Net-(U10-20): U10.20(/OE) U11.20(/OE) U12.21(/OE) U13.21(/OE)
Net-(U10-21): U10.21(A0) U10.22(A1) U10.23(A2) U10.24(A3) U10.25(A4) U10.26(A5) U10.27(A6) U10.28(A7) U10.29(A8) U10.31(A9) U10.32(A10) U10.33(A11) U10.34(A12) U10.35(A13) U10.36(A14) U10.37(A15) U11.21(A0) U11.22(A1) U11.23(A2) U11.24(A3) U11.25(A4) U11.26(A5) U11.27(A6) U11.28(A7) U11.29(A8) U11.31(A9) U11.32(A10) U11.33(A11) U11.34(A12) U11.35(A13) U11.36(A14) U11.37(A15) U12.23(I/O0) U12.24(I/O1) U12.25(I/O2) U12.26(I/O3) U12.27(I/O4) U12.28(I/O5) U12.29(I/O6) U12.30(I/O7) U13.23(I/O0) U13.24(I/O1) U13.25(I/O2) U13.26(I/O3) U13.27(I/O4) U13.28(I/O5) U13.29(I/O6) U13.30(I/O7)
Net-(U12-22): U12.22(/WE) U14.5(OUT)
Net-(U13-22): U13.22(/WE) U15.5(OUT)
Net-(U14-2): U14.2(INB) U15.1(INA)
Net-(U16-6): U16.6(E3) U17.6(E3) U18.6(E3)
Net-(U16-7): U16.7(Y7) U78.1(IN)
Net-(U16-9): U16.9(Y6) U28.1(IN)
Net-(U16-10): U16.10(Y5) U27.1(IN)
Net-(U16-11): U16.11(Y4) U26.1(IN)
Net-(U16-12): U16.12(Y3) U25.1(IN)
Net-(U16-13): U16.13(Y2) U24.1(IN)
Net-(U16-14): U16.14(Y1) U23.1(IN)
Net-(U16-15): U16.15(Y0) U77.1(IN)
Net-(U17-12): U17.12(Y3) U22.1(IN)
Net-(U17-13): U17.13(Y2) U21.1(IN)
Net-(U17-15): U17.15(Y0) U19.1(IN)
Net-(U20-1): U20.1(D7) U60.27(D7)
Net-(U20-2): U20.2(D6) U60.28(D6)
Net-(U20-3): U20.3(D5) U60.29(D5)
Net-(U20-4): U20.4(D4) U60.30(D4)
Net-(U20-5): U20.5(D3) U60.31(D3)
Net-(U20-6): U20.6(D2) U60.32(D2)
Net-(U20-7): U20.7(D1) U60.33(D1)
Net-(U20-8): U20.8(D0) U60.34(D0)
Net-(U20-10): U20.10(/RD) U60.5(/RD)
Net-(U20-11): U20.11(/WR) U60.36(/WR)
Net-(U20-12): U20.12(C//D) U60.9(A0)
Net-(U20-14): U20.14(RESET) U60.35(RESET)
Net-(U20-21): U20.21(/TXC) U20.22(/RXC)
Net-(U20-27): U20.27(TXD) U61.11(DIN1)
Net-(U20-28): U20.28(RDX) U61.9(ROUT2)
Net-(U60-4): U60.4(PA0) U64.1(INA) U64.2(INB)
Net-(U60-14): U60.14(PC0) U62.5(OUT)
Net-(U60-18): U60.18(PB0) U63.1(INA) U63.2(INB)
Net-(U60-37): U60.37(PA7) U67.1(INA) U67.2(INB)
Net-(U62-1): U62.1(INA) U62.2(INB)
Net-(U66-3): U66.3(0D) U66.4(1D) U66.7(2D) U66.8(3D) U66.13(4D) U66.14(5D) U66.17(6D) U66.18(7D)
Net-(U68-3): U68.3(0D) U68.4(1D) U68.7(2D) U68.8(3D) U68.13(4D) U68.14(5D) U68.17(6D) U68.18(7D)
Net-(U69-3): U69.3(0D) U69.4(1D) U69.7(2D) U69.8(3D) U69.13(4D) U69.14(5D) U69.17(6D) U69.18(7D) U70.3(0D) U70.4(1D) U70.7(2D) U70.8(3D) U70.13(4D) U70.14(5D) U70.17(6D) U70.18(7D) U71.3(0D) U71.4(1D) U71.7(2D) U71.8(3D) U71.13(4D) U71.14(5D) U71.17(6D) U71.18(7D) U72.3(0D) U72.4(1D) U72.7(2D) U72.8(3D) U72.13(4D) U72.14(5D) U72.17(6D) U72.18(7D) U73.3(0D) U73.4(1D) U73.7(2D) U73.8(3D) U73.13(4D) U73.14(5D) U73.17(6D) U73.18(7D) U74.3(0D) U74.4(1D) U74.7(2D) U74.8(3D) U74.13(4D) U74.14(5D) U74.17(6D) U74.18(7D) U76.3(0D) U76.4(1D) U76.7(2D) U76.8(3D) U76.13(4D) U76.14(5D) U76.17(6D) U76.18(7D)
Net-(U79-3): U79.3(0D) U79.4(1D)

Not connected (* = marked no-connect by the designer): C2 1; C3 1; SEG1 3(G1); SEG2 3(G1); SEG3 3(G1); SEG4 3(G1); SEG5 3(G1); SEG6 3(G1); SEG7 3(G1); SEG8 3(G1); SW1 2; SW2 2; SW-1SWITCH 1(P$1); SW-7SWITCH 2(P$2); SW-8SWITCH 2(P$2); SW-11SWITCH 2(P$2); SW-12SWITCH 2(P$2); U1 17(NMI) 18(INTR) 23(TEST) 24(INTA) 28(M//IO) 29(/WR) 30(HLDA) 31(HOLD) 32(/RD) 33(MN/MX); U2 10(GND) 20(VCC); U3 1(CSYNC) 2(PCLK) 3(/AEN1) 4(RDY1) 6(RDY2) 7(AEN2) 9(GND) 12(OSC) 13(F/C) 14(EFI) 15(ASYNC); U4 10(GND) 20(VCC); U5 10(GND) 12(4Q) 14(5D) 15(5Q) 16(6Q) 17(6D) 18(7D) 19(7Q) 20(VCC); U8 4(OUT); U9 1(A0) 2(A1) 3(A2) 6(E3) 8(GND) 9(Y6) 10(Y5) 11(Y4) 12(Y3) 13(Y2) 14(Y1) 16(VCC); U10 1(VPP) 38(NC) 39(PGM#); U11 1(VPP) 38(NC) 39(PGM#); U12 16(A15) 17(A16) 18(A17); U13 16(A15) 17(A16) 18(A17); U14 1(INA) 3(VDD) 4(GND); U15 2(INB) 3(VDD) 4(GND); U16 1(A0) 2(A1) 3(A2) 4(/E1) 5(/E2) 8(GND) 16(VCC); U17 1(A0) 2(A1) 3(A2) 7(Y7) 8(GND) 9(Y6) 10(Y5) 11(Y4) 16(VCC); U18 1(A0) 2(A1) 3(A2) 8(GND) 9(Y6) 12(Y3) 14(Y1) 15(Y0) 16(VCC); U19 4(OUT); U20 9(/CS) 13(CLK) 15(RESET) 16(SYNDET) 18(TxEMPTY) 19(TxD) 20(CLK) 23(RTS) 24(DTR) 25(RxC) 26(VCC); U21 4(OUT); U22 4(OUT); U23 4(OUT); U24 4(OUT); U25 4(OUT); U26 4(OUT); U27 4(OUT); U28 4(OUT); U60 1(PA3) 2(PA2) 3(PA1) 6(/CS) 7(GND) 8(A1) 26(VCC) 38(PA6) 39(PA5) 40(PA4); U61 7(T2OUT) 8(R2IN) 10(DIN2) 12(ROUT1) 13(RIN1) 14(T1OUT); U62 3(VDD) 4(GND); U63 3(VDD) 4(GND) 5(OUT); U64 3(VDD) 4(GND) 5(OUT); U65 1(1OE) 3(1Y0) 5(1Y1) 7(1Y2) 8(1A3) 9(1Y3) 10(GND) 11(2A3) 12(1Y3) 13(2A2) 14(1Y2) 15(2A1) 16(1Y1) 17(2A0) 18(1Y0) 19(2OE) 20(VCC); U66 1(G) 9(3Q) 10(GND) 12(4Q) 15(5Q) 16(6Q) 19(7Q) 20(VCC); U67 3(VDD) 4(GND) 5(OUT); U68 1(G) 10(GND) 11(OC) 20(VCC); U69 1(G) 10(GND) 20(VCC); U70 1(G) 10(GND) 20(VCC); U71 1(G) 10(GND) 20(VCC); U72 1(G) 10(GND) 20(VCC); U73 1(G) 10(GND) 20(VCC); U74 1(G) 10(GND) 20(VCC); U75 1(G) 3(0D) 4(1D) 7(2D) 8(3D) 10(GND) 13(4D) 14(5D) 17(6D) 18(7D) 20(VCC); U76 1(G) 10(GND) 20(VCC); U77 4(OUT); U78 4(OUT); U79 1(G) 6(2Q) 7(2D) 8(3D) 9(3Q) 10(GND) 11(OC) 12(4Q) 13(4D) 14(5D) 15(5Q) 16(6Q) 17(6D) 18(7D) 19(7Q) 20(VCC)

## Notes on the sheets
sheet 1
- D7
- D6
- D5
- D4
- D2
- D3
- D1
- D0
- /S51
- /RD
- /WR
- A1
- PCLK (8284)
- RESET
- /S55
- A2
- 2024-12-17
- Razvan Bitea
sheet 2
- A16-A1
- D15-D0
- RD
- /BHE
- /WR
- A0
- EPROM
- A17
- SRAM
- A18
- A19
- M//IO
- 2024-12-17
- Razvan Bitea
sheet 3
- A0-A7
- A8-A15
- A16-A19
- "1"
- D8-D16
- D0-D7
- 2024-12-17
- Razvan Bitea
sheet 4
- /ST2
- D0
- D1
- D2
- D3
- "1"
- D7-D0
- ST1
- 2024-12-17
- Razvan Bitea
sheet 5
- D7-D0
- SL1
- D1-D0
- SL2
- 2024-12-17
- Razvan Bitea
sheet 6
- SA1
- SA2
- SA3
- SA4
- A4
- A5
- SA5
- A6
- SA6
- M//IO
- SA7
- SA8
- SL1
- A4
- SL2
- A5
- A6
- ST1
- ST2
- A7
- A10
- A8
- S2
- /S55
- /S51
- S1
- 2024-12-17
- Razvan Bitea
sheet 7
- D7-D0
- SA1
- SA2
- SA3
- SA4
- SA5
- SA6
- SA7
- SA8
- 2024-12-17
- Razvan Bitea
